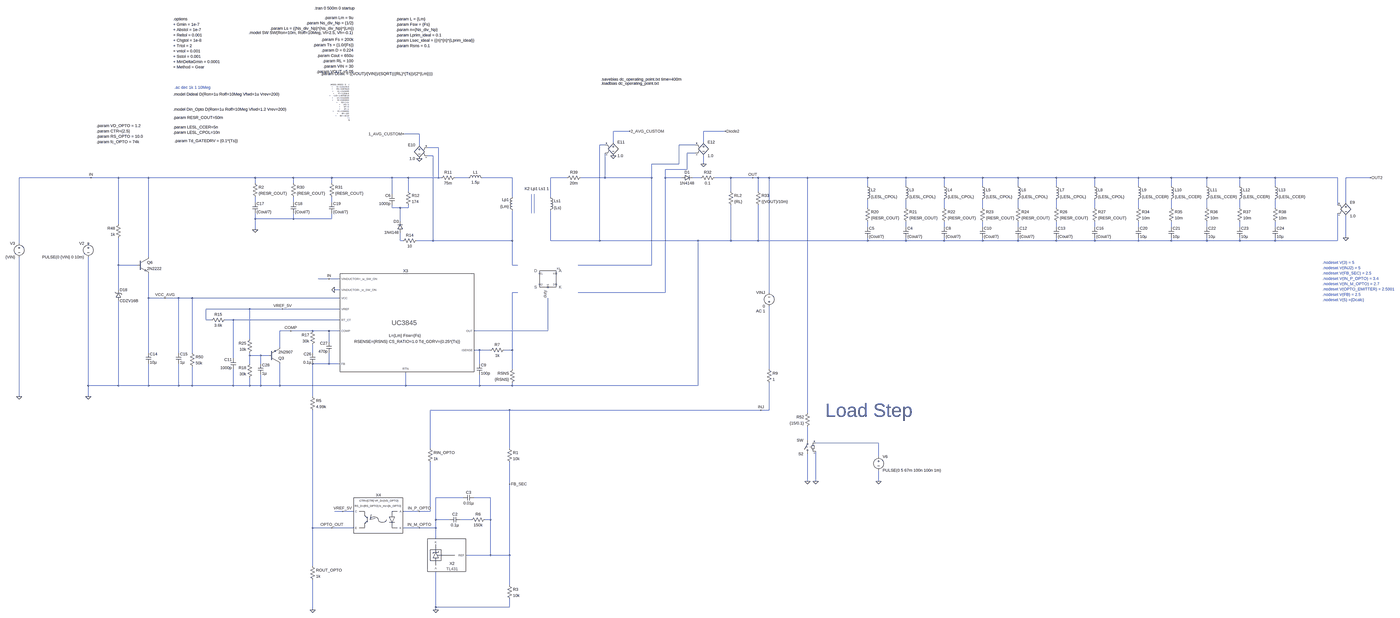
[diagram p0: schematic Demo_Flyback_AVGD_Model_Fsw_200kHz.asc, whole sheet]
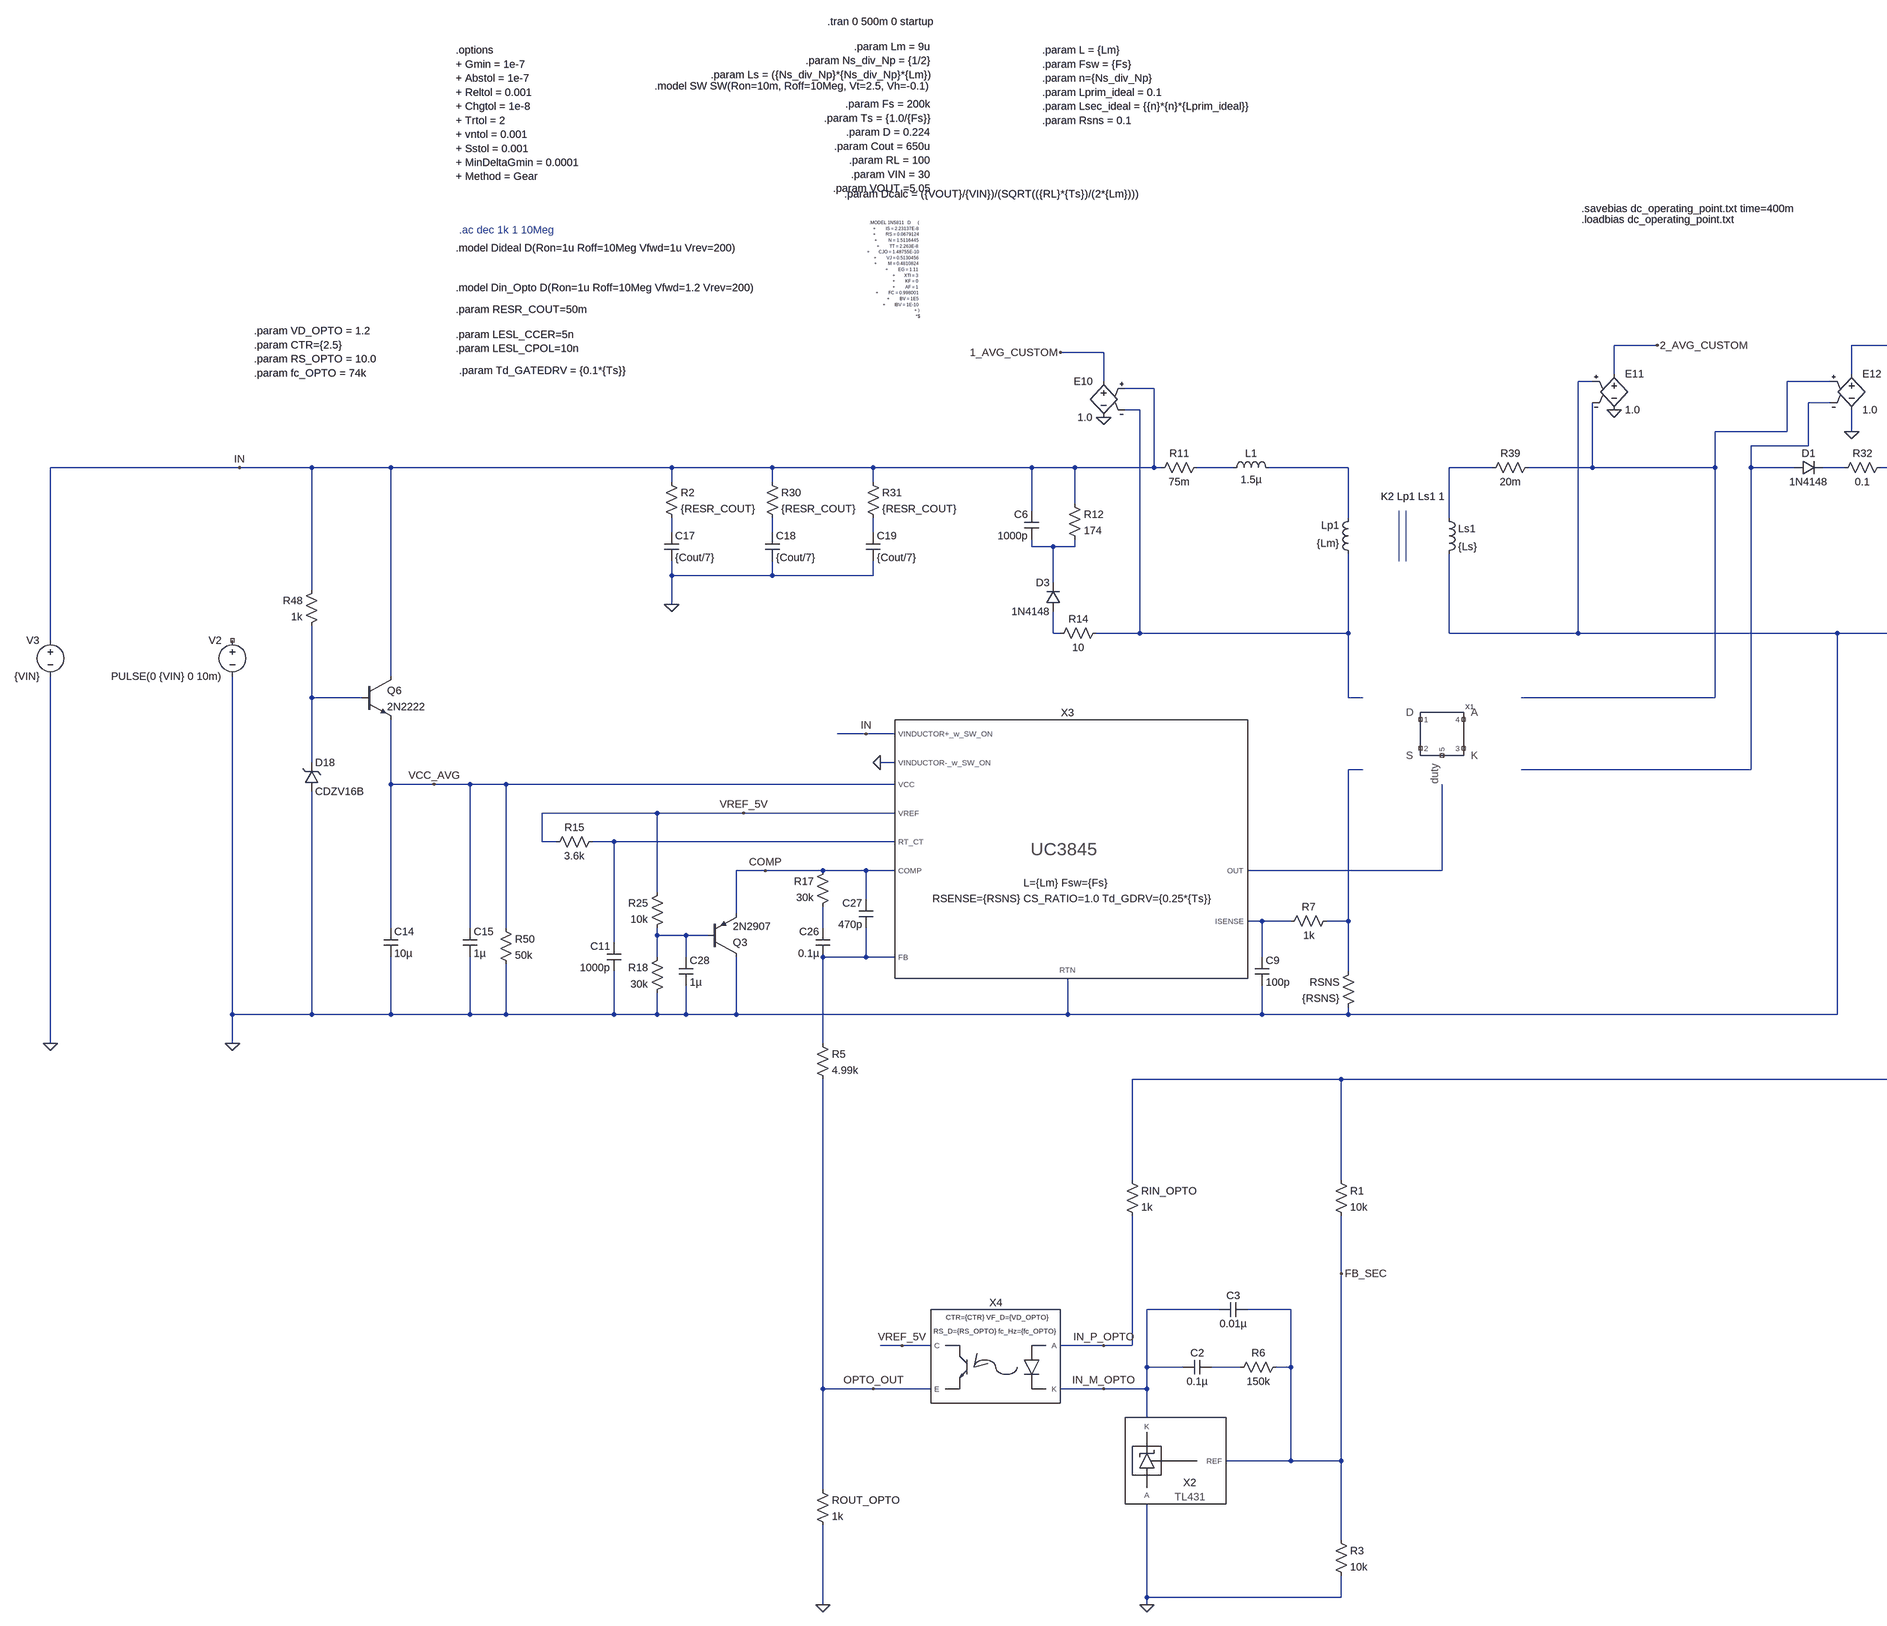
[diagram p1: schematic Demo_Flyback_AVGD_Model_Fsw_200kHz.asc, part, row 1 of 1, column 1 of 2]
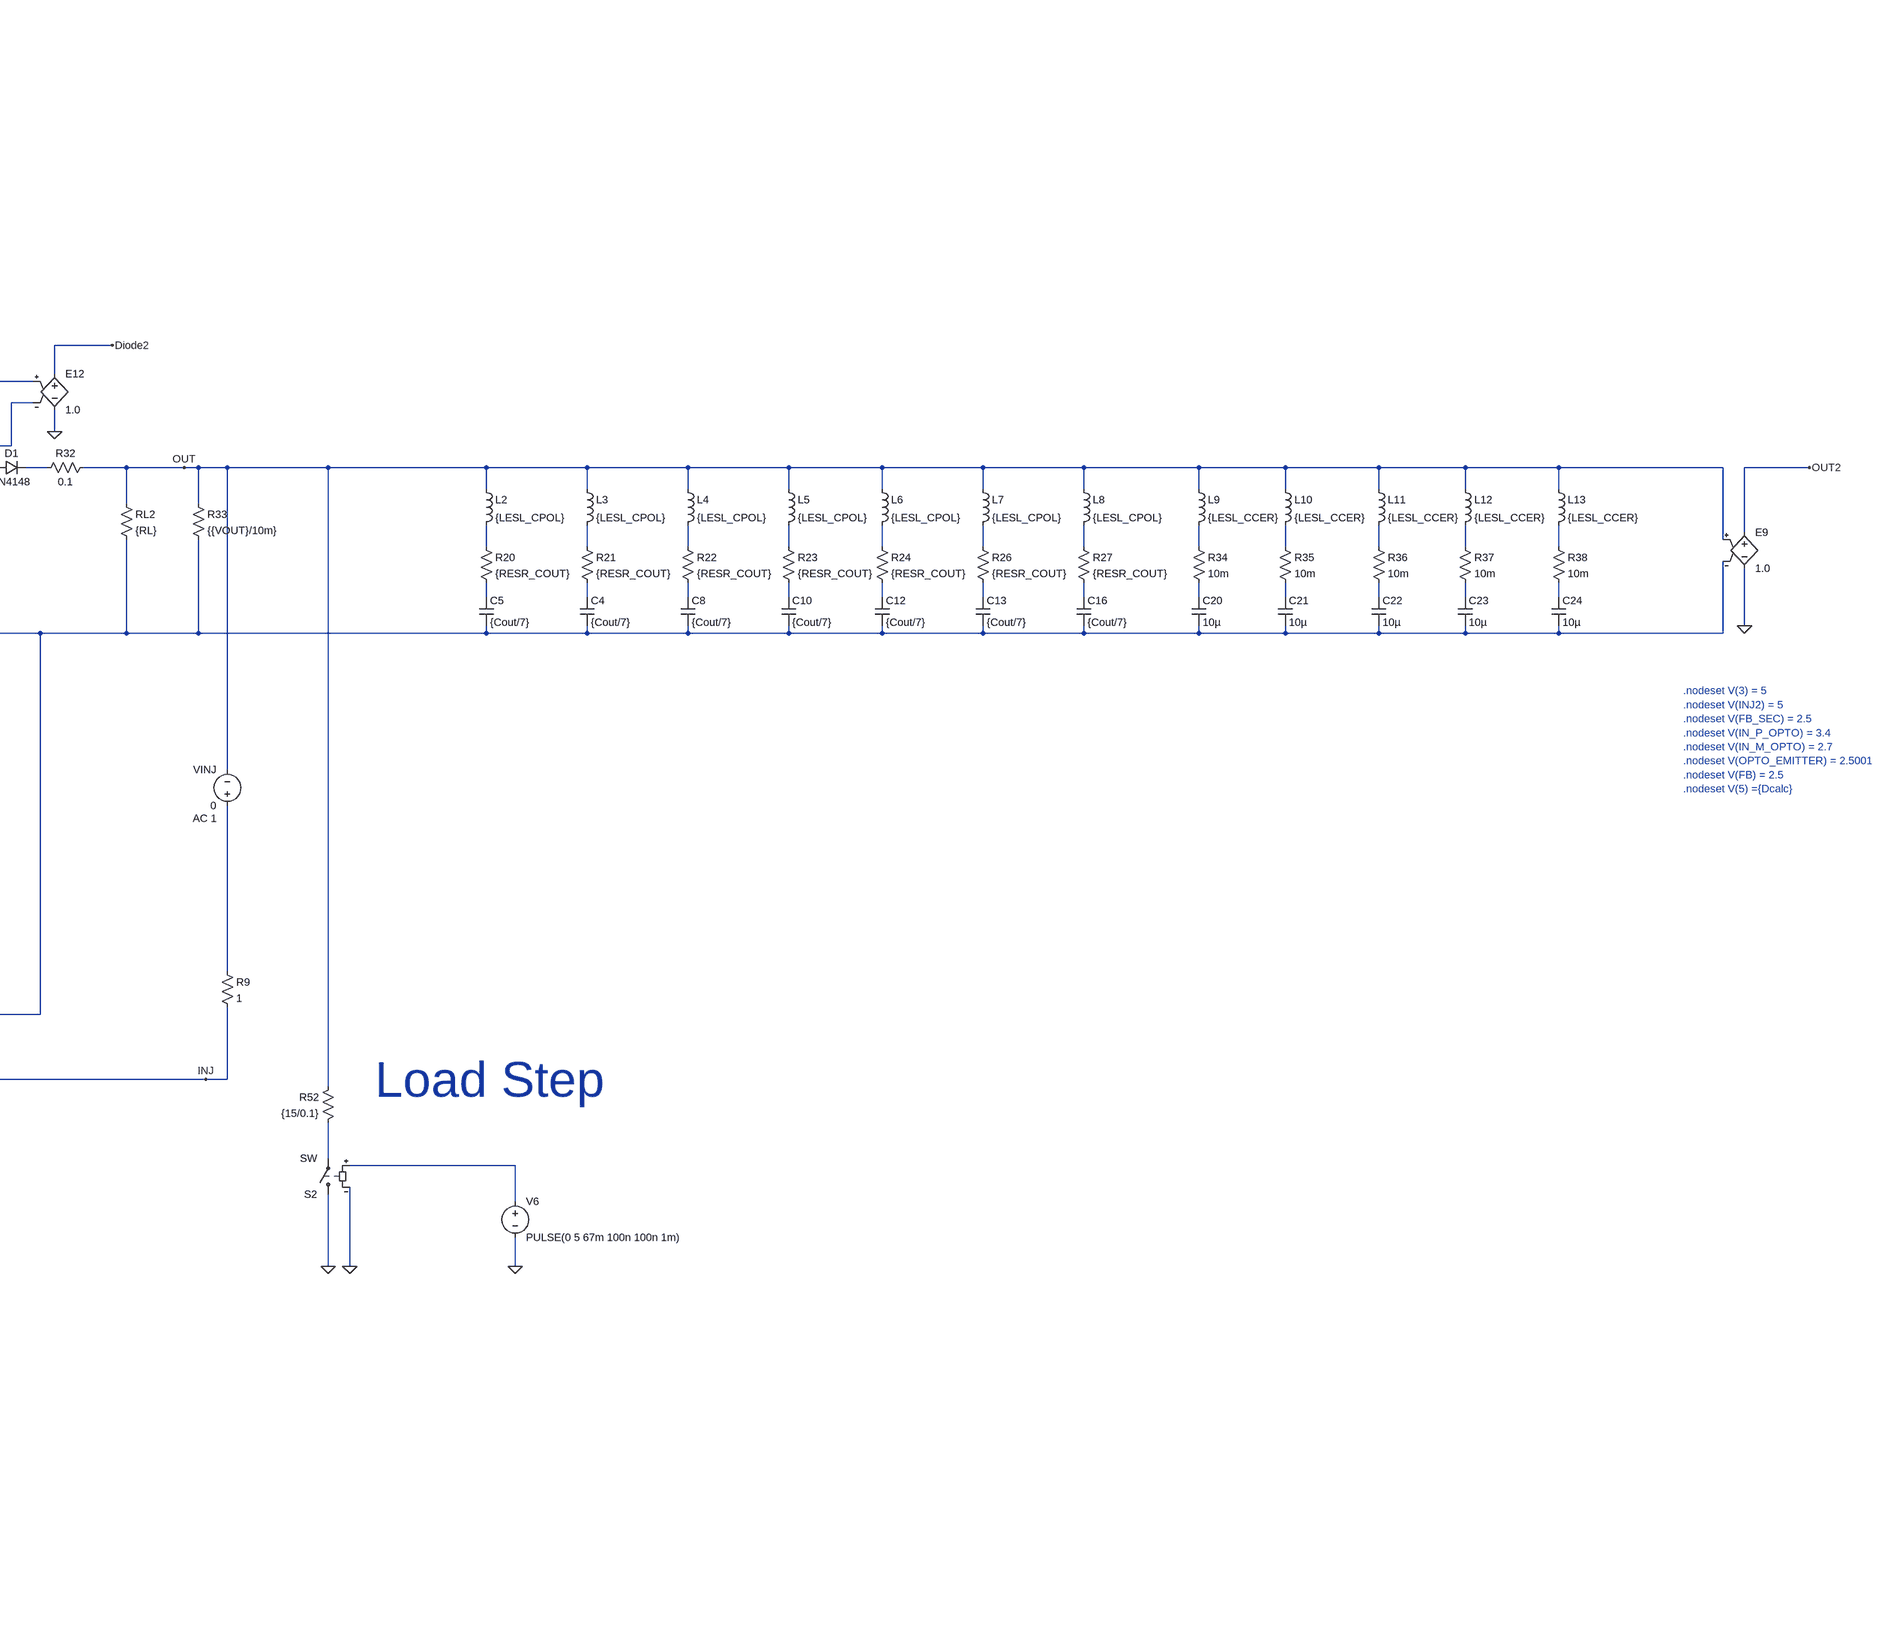
[diagram p2: schematic Demo_Flyback_AVGD_Model_Fsw_200kHz.asc, part, row 1 of 1, column 2 of 2]
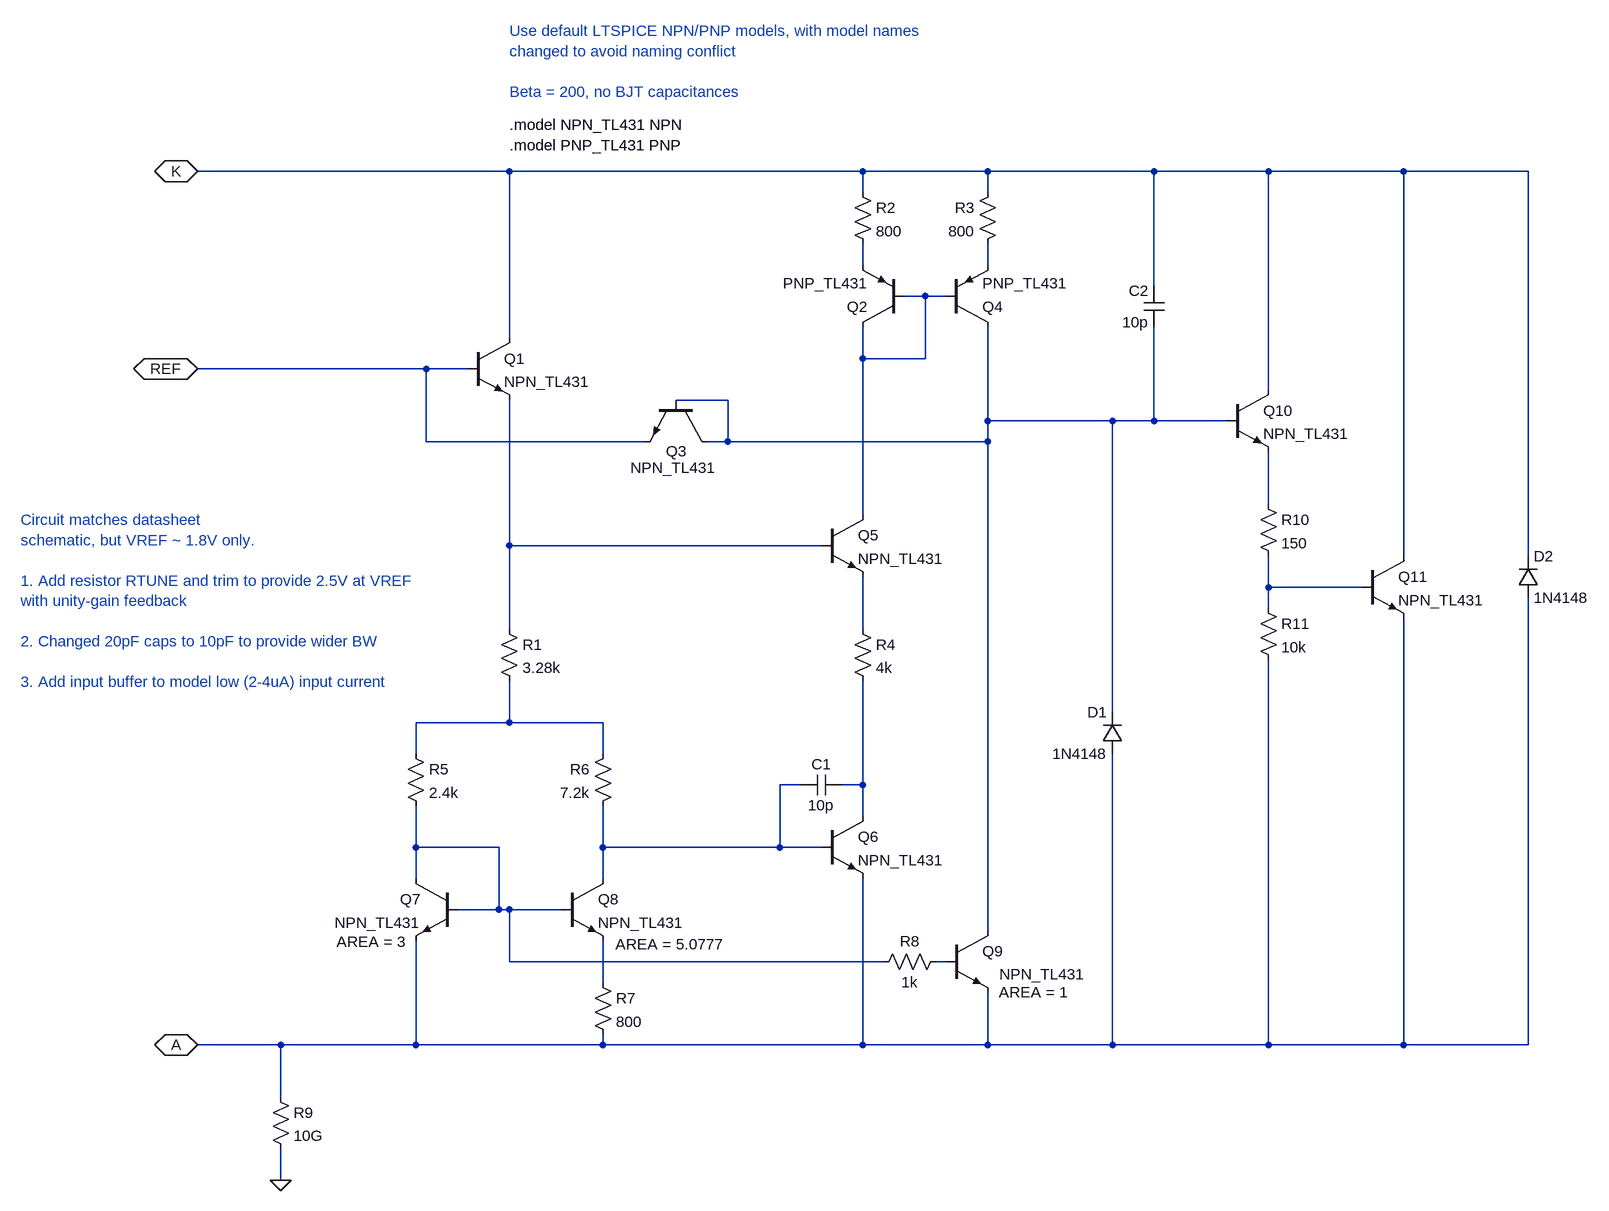
[diagram p3: sub-circuit tl431.asc]
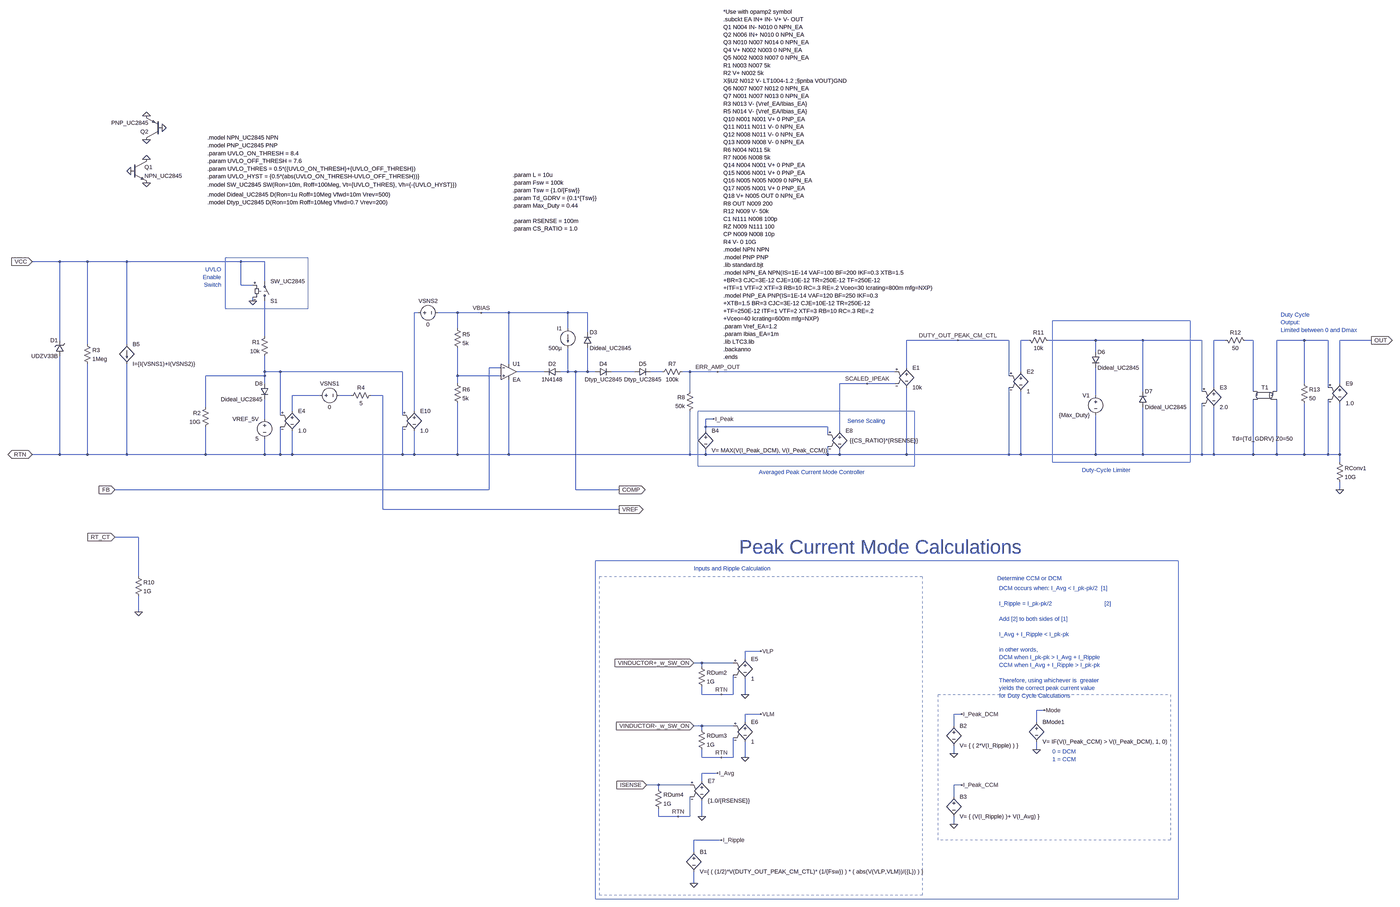
[diagram p4: sub-circuit uc3845_avg.asc, whole sheet]
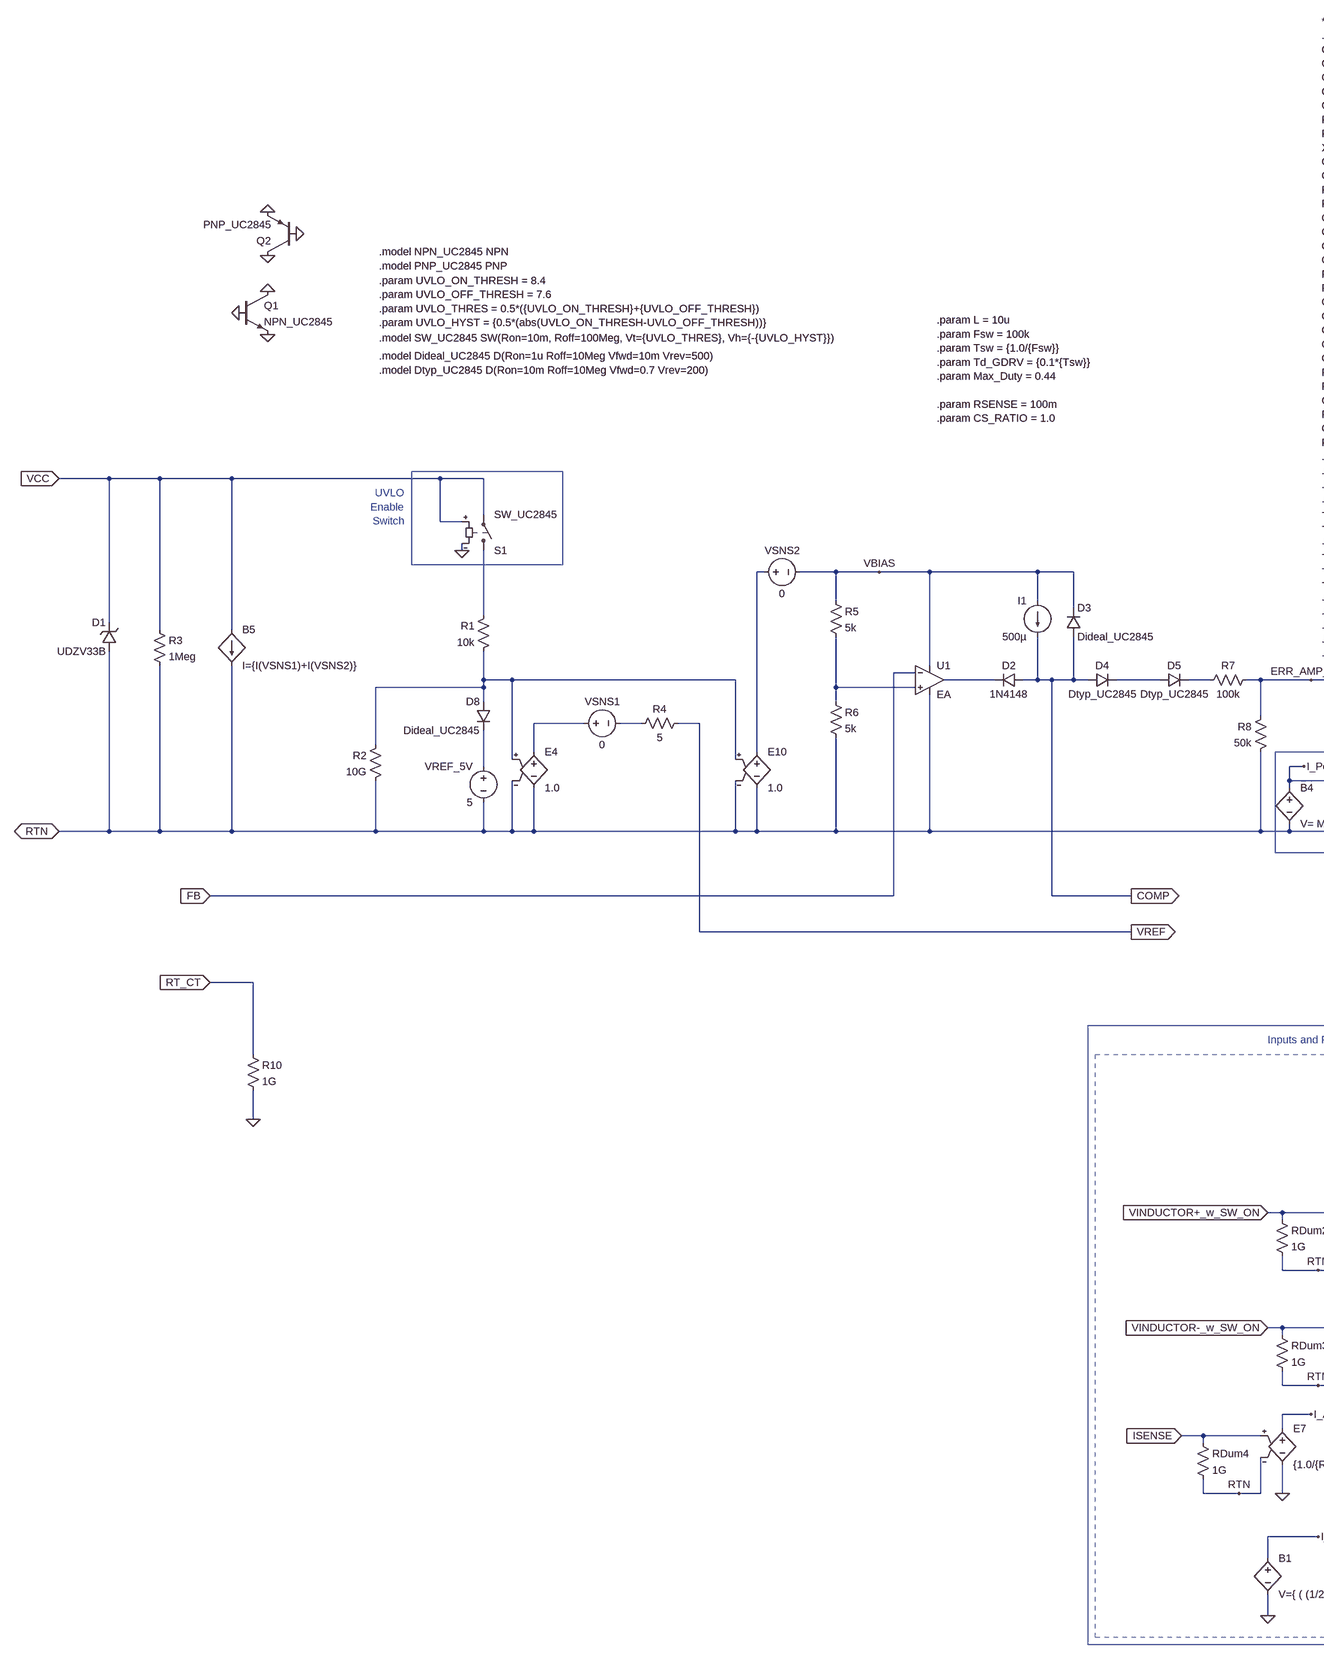
[diagram p5: sub-circuit uc3845_avg.asc, part, row 1 of 1, column 1 of 2]
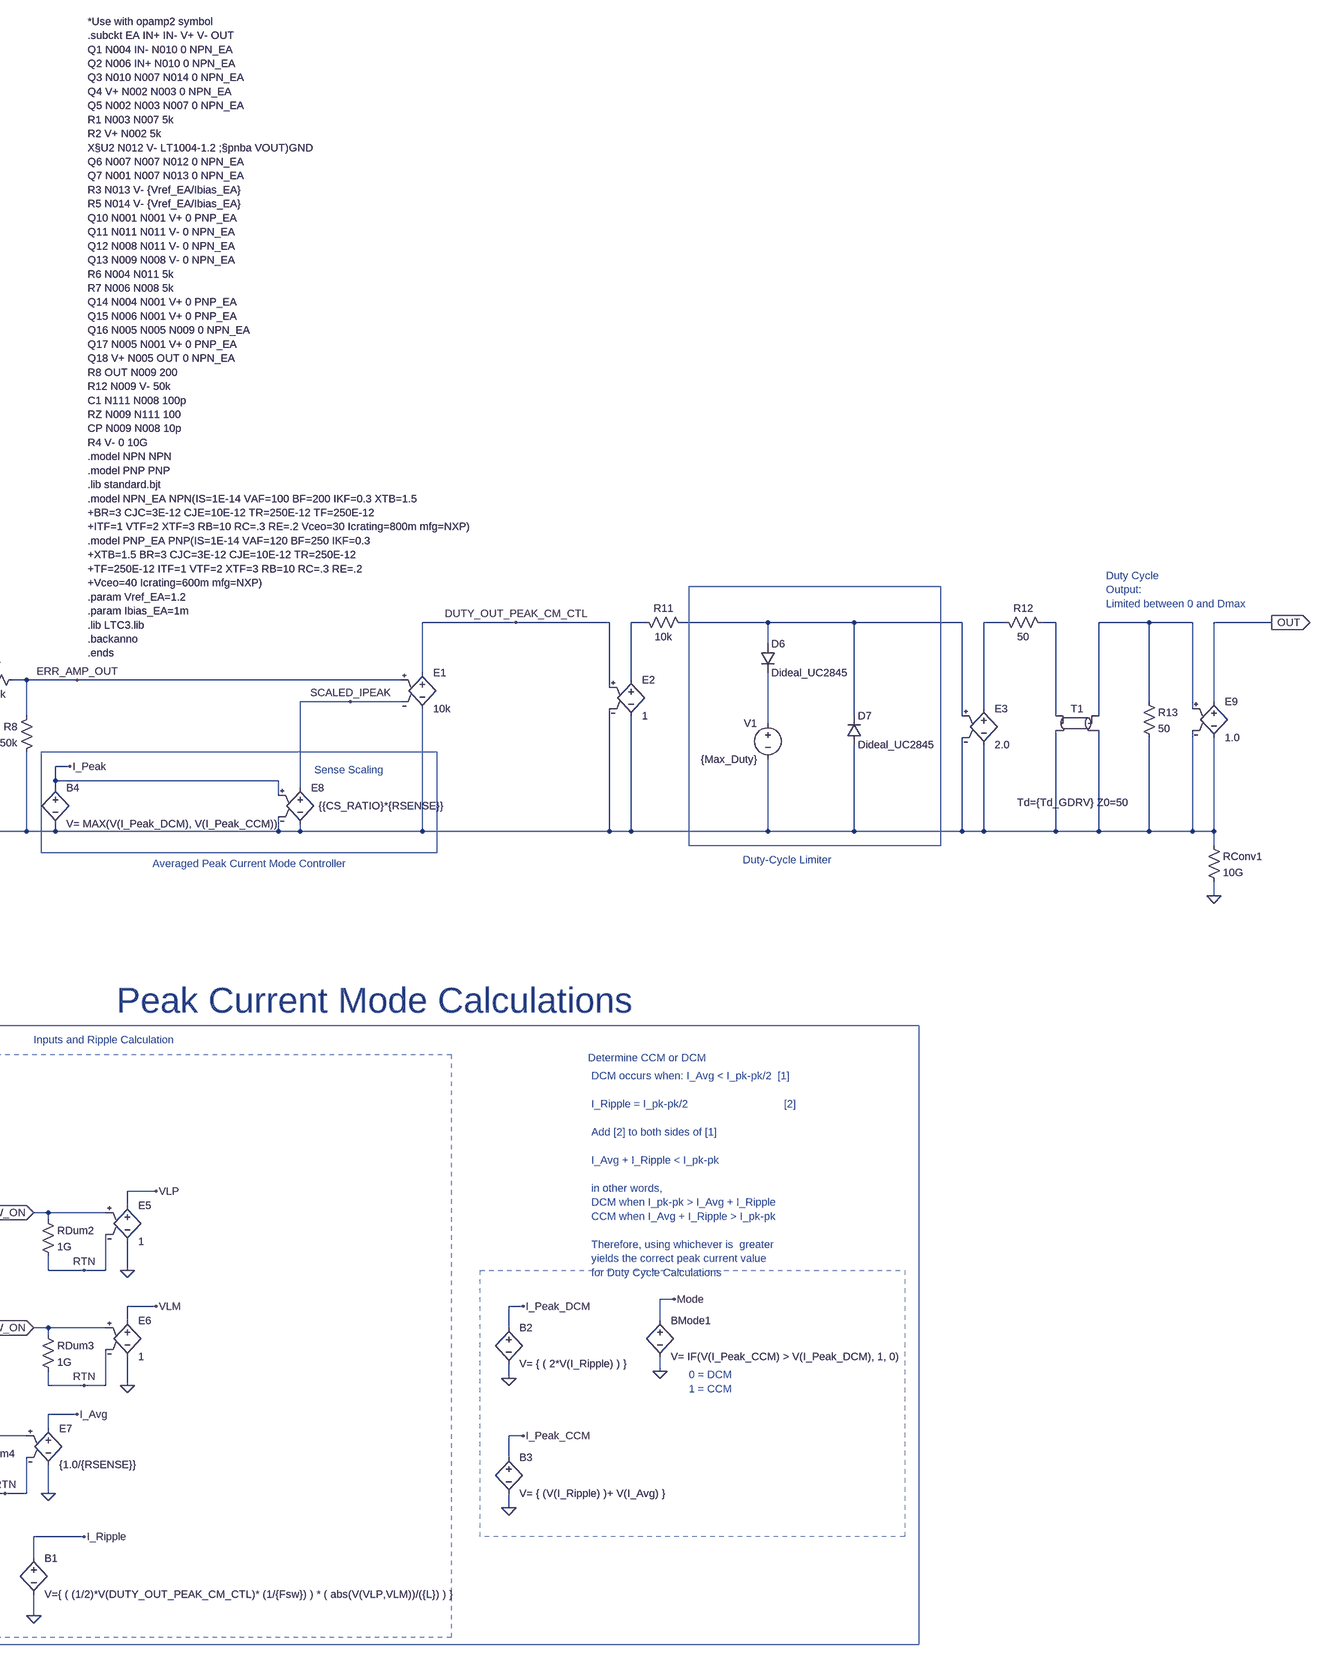
[diagram p6: sub-circuit uc3845_avg.asc, part, row 1 of 1, column 2 of 2]
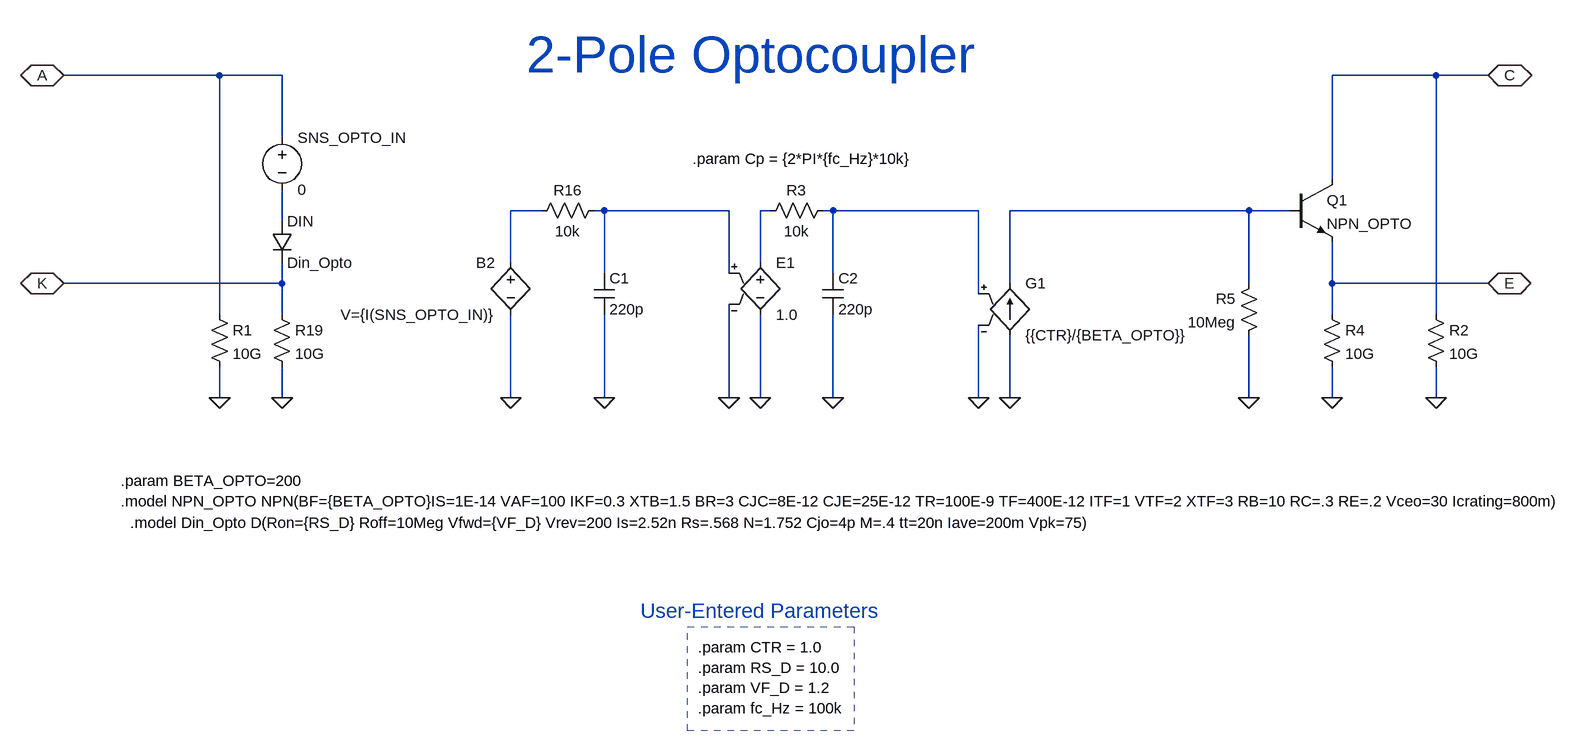
[diagram p7: sub-circuit opto_two_pole.asc]
Demo_Flyback_AVGD_Model_Fsw_200kHz.asc, the LTspice schematic file:
Version 4.1
SHEET 1 8320 5380
WIRE 3824 672 3728 672
WIRE 4384 672 4256 672
WIRE 2592 688 2496 688
WIRE 3728 736 3728 672
WIRE 4256 736 4256 672
WIRE 2592 752 2592 688
WIRE 3680 752 3648 752
WIRE 4208 752 4112 752
WIRE 2704 768 2640 768
WIRE 4208 800 4160 800
WIRE 2672 816 2640 816
WIRE 4112 864 4112 752
WIRE 4112 864 3952 864
WIRE 4256 864 4256 816
WIRE 4160 896 4160 800
WIRE 4160 896 4032 896
WIRE 672 944 240 944
WIRE 832 944 672 944
WIRE 1008 944 832 944
WIRE 1632 944 1008 944
WIRE 1856 944 1632 944
WIRE 2080 944 1856 944
WIRE 2432 944 2080 944
WIRE 2528 944 2432 944
WIRE 2704 944 2704 768
WIRE 2704 944 2528 944
WIRE 2720 944 2704 944
WIRE 2880 944 2800 944
WIRE 3136 944 2960 944
WIRE 3456 944 3360 944
WIRE 3680 944 3680 800
WIRE 3680 944 3536 944
WIRE 3952 944 3952 864
WIRE 3952 944 3680 944
WIRE 4032 944 4032 896
WIRE 4128 944 4032 944
WIRE 4240 944 4192 944
WIRE 4416 944 4320 944
WIRE 4544 944 4416 944
WIRE 4576 944 4544 944
WIRE 4640 944 4576 944
WIRE 4864 944 4640 944
WIRE 5216 944 4864 944
WIRE 5440 944 5216 944
WIRE 5664 944 5440 944
WIRE 5888 944 5664 944
WIRE 6096 944 5888 944
WIRE 6320 944 6096 944
WIRE 6544 944 6320 944
WIRE 6800 944 6544 944
WIRE 6992 944 6800 944
WIRE 7200 944 6992 944
WIRE 7392 944 7200 944
WIRE 7600 944 7392 944
WIRE 7968 944 7600 944
WIRE 8160 944 8016 944
WIRE 1632 976 1632 944
WIRE 1856 976 1856 944
WIRE 2080 976 2080 944
WIRE 5216 992 5216 944
WIRE 5440 992 5440 944
WIRE 5664 992 5664 944
WIRE 5888 992 5888 944
WIRE 6096 992 6096 944
WIRE 6320 992 6320 944
WIRE 6544 992 6544 944
WIRE 6800 992 6800 944
WIRE 6992 992 6992 944
WIRE 7200 992 7200 944
WIRE 7392 992 7392 944
WIRE 7600 992 7600 944
WIRE 2528 1024 2528 944
WIRE 4416 1024 4416 944
WIRE 4576 1024 4576 944
WIRE 2432 1040 2432 944
WIRE 3136 1056 3136 944
WIRE 3360 1056 3360 944
WIRE 1632 1088 1632 1056
WIRE 1856 1088 1856 1056
WIRE 2080 1088 2080 1056
WIRE 8016 1088 8016 944
WIRE 7968 1104 7968 944
WIRE 2432 1120 2432 1104
WIRE 2480 1120 2432 1120
WIRE 2528 1120 2528 1104
WIRE 2528 1120 2480 1120
WIRE 5216 1120 5216 1072
WIRE 5440 1120 5440 1072
WIRE 5664 1120 5664 1072
WIRE 5888 1120 5888 1072
WIRE 6096 1120 6096 1072
WIRE 6320 1120 6320 1072
WIRE 6544 1120 6544 1072
WIRE 6800 1120 6800 1072
WIRE 6992 1120 6992 1072
WIRE 7200 1120 7200 1072
WIRE 7392 1120 7392 1072
WIRE 7600 1120 7600 1072
WIRE 1632 1184 1632 1152
WIRE 1856 1184 1856 1152
WIRE 1856 1184 1632 1184
WIRE 2080 1184 2080 1152
WIRE 2080 1184 1856 1184
WIRE 2480 1200 2480 1120
WIRE 832 1216 832 944
WIRE 5216 1232 5216 1200
WIRE 5440 1232 5440 1200
WIRE 5664 1232 5664 1200
WIRE 5888 1232 5888 1200
WIRE 6096 1232 6096 1200
WIRE 6320 1232 6320 1200
WIRE 6544 1232 6544 1200
WIRE 6800 1232 6800 1200
WIRE 6992 1232 6992 1200
WIRE 7200 1232 7200 1200
WIRE 7392 1232 7392 1200
WIRE 7600 1232 7600 1200
WIRE 1632 1248 1632 1184
WIRE 8016 1296 8016 1168
WIRE 2480 1312 2480 1264
WIRE 2496 1312 2480 1312
WIRE 2672 1312 2672 816
WIRE 2672 1312 2576 1312
WIRE 3136 1312 3136 1136
WIRE 3136 1312 2672 1312
WIRE 3360 1312 3360 1136
WIRE 3648 1312 3648 752
WIRE 3648 1312 3360 1312
WIRE 4224 1312 3648 1312
WIRE 4416 1312 4416 1104
WIRE 4416 1312 4224 1312
WIRE 4576 1312 4576 1104
WIRE 4576 1312 4416 1312
WIRE 5216 1312 5216 1296
WIRE 5216 1312 4576 1312
WIRE 5440 1312 5440 1296
WIRE 5440 1312 5216 1312
WIRE 5664 1312 5664 1296
WIRE 5664 1312 5440 1312
WIRE 5888 1312 5888 1296
WIRE 5888 1312 5664 1312
WIRE 6096 1312 6096 1296
WIRE 6096 1312 5888 1312
WIRE 6320 1312 6320 1296
WIRE 6320 1312 6096 1312
WIRE 6544 1312 6544 1296
WIRE 6544 1312 6320 1312
WIRE 6800 1312 6800 1296
WIRE 6800 1312 6544 1312
WIRE 6992 1312 6992 1296
WIRE 6992 1312 6800 1312
WIRE 7200 1312 7200 1296
WIRE 7200 1312 6992 1312
WIRE 7392 1312 7392 1296
WIRE 7392 1312 7200 1312
WIRE 7600 1312 7600 1296
WIRE 7600 1312 7392 1312
WIRE 7968 1312 7968 1152
WIRE 7968 1312 7600 1312
WIRE 240 1328 240 944
WIRE 1008 1408 1008 944
WIRE 832 1456 832 1296
WIRE 944 1456 832 1456
WIRE 3136 1456 3136 1312
WIRE 3168 1456 3136 1456
WIRE 3952 1456 3952 944
WIRE 3952 1456 3520 1456
WIRE 2064 1536 2000 1536
WIRE 2128 1536 2064 1536
WIRE 832 1600 832 1456
WIRE 2128 1600 2096 1600
WIRE 3168 1616 3136 1616
WIRE 4032 1616 4032 944
WIRE 4032 1616 3520 1616
WIRE 4640 1616 4640 944
WIRE 1008 1648 1008 1504
WIRE 1104 1648 1008 1648
WIRE 1184 1648 1104 1648
WIRE 1264 1648 1184 1648
WIRE 2128 1648 1264 1648
WIRE 1600 1712 1344 1712
WIRE 1792 1712 1600 1712
WIRE 2128 1712 1792 1712
WIRE 1344 1776 1344 1712
WIRE 1376 1776 1344 1776
WIRE 1504 1776 1456 1776
WIRE 2128 1776 1504 1776
WIRE 1840 1840 1776 1840
WIRE 1968 1840 1840 1840
WIRE 2064 1840 1968 1840
WIRE 2128 1840 2064 1840
WIRE 3344 1840 3344 1648
WIRE 3344 1840 2912 1840
WIRE 1600 1888 1600 1712
WIRE 2064 1904 2064 1840
WIRE 1776 1936 1776 1840
WIRE 2944 1952 2912 1952
WIRE 3008 1952 2944 1952
WIRE 3136 1952 3136 1616
WIRE 3136 1952 3088 1952
WIRE 1008 1968 1008 1648
WIRE 1184 1968 1184 1648
WIRE 1264 1968 1264 1648
WIRE 1968 1968 1968 1920
WIRE 1600 1984 1600 1968
WIRE 1664 1984 1600 1984
WIRE 1712 1984 1664 1984
WIRE 1504 2000 1504 1776
WIRE 1600 2032 1600 1984
WIRE 1664 2032 1664 1984
WIRE 1968 2032 1968 2016
WIRE 2064 2032 2064 1968
WIRE 2064 2032 1968 2032
WIRE 2128 2032 2064 2032
WIRE 2944 2032 2944 1952
WIRE 3136 2064 3136 1952
WIRE 4640 2064 4640 1696
WIRE 656 2160 656 1408
WIRE 832 2160 832 1664
WIRE 832 2160 656 2160
WIRE 1008 2160 1008 2032
WIRE 1008 2160 832 2160
WIRE 1184 2160 1184 2032
WIRE 1184 2160 1008 2160
WIRE 1264 2160 1264 2048
WIRE 1264 2160 1184 2160
WIRE 1504 2160 1504 2064
WIRE 1504 2160 1264 2160
WIRE 1600 2160 1600 2112
WIRE 1600 2160 1504 2160
WIRE 1664 2160 1664 2096
WIRE 1664 2160 1600 2160
WIRE 1776 2160 1776 2032
WIRE 1776 2160 1664 2160
WIRE 2512 2160 2512 2080
WIRE 2512 2160 1776 2160
WIRE 2944 2160 2944 2096
WIRE 2944 2160 2512 2160
WIRE 3136 2160 3136 2144
WIRE 3136 2160 2944 2160
WIRE 4224 2160 4224 1312
WIRE 4224 2160 3136 2160
WIRE 240 2224 240 1408
WIRE 656 2224 656 2160
WIRE 1968 2224 1968 2032
WIRE 3120 2304 2656 2304
WIRE 4592 2304 3120 2304
WIRE 4640 2304 4640 2144
WIRE 4640 2304 4592 2304
WIRE 4864 2320 4864 944
WIRE 4864 2480 4864 2400
WIRE 5280 2496 4912 2496
WIRE 2656 2528 2656 2304
WIRE 3120 2528 3120 2304
WIRE 5280 2576 5280 2496
WIRE 4864 2720 4864 2560
WIRE 4912 2720 4912 2544
WIRE 5280 2720 5280 2656
WIRE 3120 2736 3120 2608
WIRE 2848 2816 2688 2816
WIRE 3008 2816 2912 2816
WIRE 2144 2896 2096 2896
WIRE 2208 2896 2144 2896
WIRE 2592 2896 2496 2896
WIRE 2656 2896 2656 2608
WIRE 2656 2896 2592 2896
WIRE 2688 2944 2688 2816
WIRE 2768 2944 2688 2944
WIRE 2896 2944 2832 2944
WIRE 3008 2944 3008 2816
WIRE 3008 2944 2976 2944
WIRE 1968 2992 1968 2304
WIRE 2080 2992 1968 2992
WIRE 2208 2992 2080 2992
WIRE 2592 2992 2496 2992
WIRE 2688 2992 2688 2944
WIRE 2688 2992 2592 2992
WIRE 2688 3056 2688 2992
WIRE 3008 3152 3008 2944
WIRE 3008 3152 2864 3152
WIRE 3120 3152 3120 2736
WIRE 3120 3152 3008 3152
WIRE 1968 3216 1968 2992
WIRE 3120 3328 3120 3152
WIRE 2688 3456 2688 3248
WIRE 3120 3456 3120 3408
WIRE 3120 3456 2688 3456
WIRE 1968 3472 1968 3296
WIRE 2688 3472 2688 3456
FLAG 8016 1296 0
FLAG 8160 944 OUT2
FLAG 2592 832 0
FLAG 3728 816 0
FLAG 2496 688 1_AVG_CUSTOM
FLAG 3824 672 2_AVG_CUSTOM
FLAG 4256 864 0
FLAG 4384 672 Diode2
FLAG 1104 1648 VCC_AVG
FLAG 4864 2720 0
FLAG 4912 2720 0
FLAG 5280 2720 0
FLAG 656 2224 0
FLAG 672 944 IN
FLAG 4592 2304 INJ
FLAG 2688 3472 0
FLAG 3120 2736 FB_SEC
FLAG 2592 2992 IN_M_OPTO
FLAG 4544 944 OUT
FLAG 240 2224 0
FLAG 1632 1248 0
FLAG 2064 1536 IN
FLAG 2096 1600 0
FLAG 1792 1712 VREF_5V
FLAG 2592 2896 IN_P_OPTO
FLAG 1968 3472 0
FLAG 2144 2896 VREF_5V
FLAG 1840 1840 COMP
FLAG 2080 2992 OPTO_OUT
DATAFLAG 4672 944 ""
DATAFLAG 2352 944 ""
DATAFLAG 3056 3152 ""
DATAFLAG 1264 1648 ""
DATAFLAG 4224 2080 ""
DATAFLAG 2656 2736 ""
DATAFLAG 2736 2816 ""
DATAFLAG 1968 2912 ""
DATAFLAG 1984 1712 ""
DATAFLAG 1984 1648 ""
DATAFLAG 2992 1840 ""
DATAFLAG 2032 1840 ""
SYMBOL res 4400 1008 R0
SYMATTR InstName RL2
SYMATTR Value {RL}
SYMBOL cap 5200 1232 R0
SYMATTR InstName C5
SYMATTR Value {Cout/7}
SYMBOL e 8016 1072 R0
SYMATTR InstName E9
SYMATTR Value 1.0
SYMBOL res 2704 960 R270
WINDOW 0 32 56 VTop 2
WINDOW 3 0 56 VBottom 2
SYMATTR InstName R11
SYMATTR Value 75m
SYMBOL e 2592 736 M0
SYMATTR InstName E10
SYMATTR Value 1.0
SYMBOL e 3728 720 R0
SYMATTR InstName E11
SYMATTR Value 1.0
SYMBOL diode 2496 1264 R180
WINDOW 0 24 64 Left 2
WINDOW 3 24 0 Left 2
SYMATTR InstName D3
SYMATTR Value 1N4148
SYMBOL cap 2448 1040 M0
SYMATTR InstName C6
SYMATTR Value 1000p
SYMBOL res 2512 1008 R0
SYMATTR InstName R12
SYMATTR Value 174
SYMBOL e 4256 720 R0
SYMATTR InstName E12
SYMATTR Value 1.0
SYMBOL res 2592 1296 R90
WINDOW 0 0 56 VBottom 2
WINDOW 3 32 56 VTop 2
SYMATTR InstName R14
SYMATTR Value 10
SYMBOL res 3152 2048 M0
SYMATTR InstName RSNS
SYMATTR Value {RSNS}
SYMBOL zener 816 1664 M180
WINDOW 0 24 64 Left 2
WINDOW 3 24 0 Left 2
SYMATTR InstName D18
SYMATTR Value CDZV16B
SYMBOL res 848 1200 M0
SYMATTR InstName R48
SYMATTR Value 1k
SYMBOL npn 944 1408 R0
SYMATTR InstName Q6
SYMATTR Value 2N2222
SYMBOL cap 992 1968 R0
SYMATTR InstName C14
SYMATTR Value 10µ
SYMBOL cap 1168 1968 R0
SYMATTR InstName C15
SYMATTR Value 1µ
SYMBOL res 1248 1952 R0
SYMATTR InstName R50
SYMATTR Value 50k
SYMBOL sw 4864 2576 R180
SYMATTR InstName S2
SYMBOL res 4880 2304 M0
SYMATTR InstName R52
SYMATTR Value {15/0.1}
SYMBOL voltage 5280 2560 R0
WINDOW 123 0 0 Left 0
WINDOW 39 0 0 Left 0
SYMATTR InstName V6
SYMATTR Value PULSE(0 5 67m 100n 100n 1m)
SYMBOL ind 3152 1152 R180
WINDOW 0 36 80 Left 2
WINDOW 3 36 40 Left 2
SYMATTR InstName Lp1
SYMATTR Value {Lm}
SYMATTR Type ind
SYMBOL ind 3344 1040 R0
SYMATTR InstName Ls1
SYMATTR Value {Ls}
SYMATTR Type ind
SYMBOL voltage 656 1312 M0
WINDOW 123 0 0 Left 0
WINDOW 39 0 0 Left 0
SYMATTR InstName V2
SYMATTR Value PULSE(0 {VIN} 0 10m)
SYMBOL res 3104 2512 R0
SYMATTR InstName R1
SYMATTR Value 10k
SYMBOL res 3104 3312 R0
SYMATTR InstName R3
SYMATTR Value 10k
SYMBOL cap 2832 2928 R90
WINDOW 0 0 32 VBottom 2
WINDOW 3 32 32 VTop 2
SYMATTR InstName C2
SYMATTR Value 0.1µ
SYMBOL res 2992 2928 R90
WINDOW 0 0 56 VBottom 2
WINDOW 3 32 56 VTop 2
SYMATTR InstName R6
SYMATTR Value 150k
SYMBOL res 2640 2512 R0
SYMATTR InstName RIN_OPTO
SYMATTR Value 1k
SYMBOL res 4624 2048 R0
SYMATTR InstName R9
SYMATTR Value 1
SYMBOL cap 2912 2800 R90
WINDOW 0 0 32 VBottom 2
WINDOW 3 32 32 VTop 2
SYMATTR InstName C3
SYMATTR Value 0.01µ
SYMBOL voltage 4640 1712 R180
WINDOW 0 24 96 Left 2
WINDOW 3 24 16 Left 2
WINDOW 123 24 -12 Left 2
WINDOW 39 0 0 Left 0
SYMATTR InstName VINJ
SYMATTR Value 0
SYMATTR Value2 AC 1
SYMBOL TL431 2752 3152 M0
SYMATTR InstName X2
SYMBOL voltage 240 1312 M0
WINDOW 123 0 0 Left 0
WINDOW 39 0 0 Left 0
SYMATTR InstName V3
SYMATTR Value {VIN}
SYMBOL res 5200 1104 R0
SYMATTR InstName R20
SYMATTR Value {RESR_COUT}
SYMBOL diode 4128 960 R270
WINDOW 0 32 32 VTop 2
WINDOW 3 0 32 VBottom 2
SYMATTR InstName D1
SYMATTR Value 1N4148
SYMBOL cap 5424 1232 R0
SYMATTR InstName C4
SYMATTR Value {Cout/7}
SYMBOL res 5424 1104 R0
SYMATTR InstName R21
SYMATTR Value {RESR_COUT}
SYMBOL cap 5648 1232 R0
SYMATTR InstName C8
SYMATTR Value {Cout/7}
SYMBOL res 5648 1104 R0
SYMATTR InstName R22
SYMATTR Value {RESR_COUT}
SYMBOL cap 5872 1232 R0
SYMATTR InstName C10
SYMATTR Value {Cout/7}
SYMBOL res 5872 1104 R0
SYMATTR InstName R23
SYMATTR Value {RESR_COUT}
SYMBOL cap 6080 1232 R0
SYMATTR InstName C12
SYMATTR Value {Cout/7}
SYMBOL res 6080 1104 R0
SYMATTR InstName R24
SYMATTR Value {RESR_COUT}
SYMBOL cap 6304 1232 R0
SYMATTR InstName C13
SYMATTR Value {Cout/7}
SYMBOL res 6304 1104 R0
SYMATTR InstName R26
SYMATTR Value {RESR_COUT}
SYMBOL cap 6528 1232 R0
SYMATTR InstName C16
SYMATTR Value {Cout/7}
SYMBOL res 6528 1104 R0
SYMATTR InstName R27
SYMATTR Value {RESR_COUT}
SYMBOL ind 2864 960 R270
WINDOW 0 32 56 VTop 2
WINDOW 3 5 56 VBottom 2
SYMATTR InstName L1
SYMATTR Value 1.5µ
SYMBOL cap 1616 1088 R0
SYMATTR InstName C17
SYMATTR Value {Cout/7}
SYMBOL res 1616 960 R0
SYMATTR InstName R2
SYMATTR Value {RESR_COUT}
SYMBOL cap 1840 1088 R0
SYMATTR InstName C18
SYMATTR Value {Cout/7}
SYMBOL res 1840 960 R0
SYMATTR InstName R30
SYMATTR Value {RESR_COUT}
SYMBOL cap 2064 1088 R0
SYMATTR InstName C19
SYMATTR Value {Cout/7}
SYMBOL res 2064 960 R0
SYMATTR InstName R31
SYMATTR Value {RESR_COUT}
SYMBOL res 4336 928 R90
WINDOW 0 0 56 VBottom 2
WINDOW 3 32 56 VTop 2
SYMATTR InstName R32
SYMATTR Value 0.1
SYMBOL res 4560 1008 R0
SYMATTR InstName R33
SYMATTR Value {{VOUT}/10m}
SYMBOL ind 5200 976 R0
SYMATTR InstName L2
SYMATTR Value {LESL_CPOL}
SYMBOL ind 5424 976 R0
SYMATTR InstName L3
SYMATTR Value {LESL_CPOL}
SYMBOL ind 5648 976 R0
SYMATTR InstName L4
SYMATTR Value {LESL_CPOL}
SYMBOL ind 5872 976 R0
SYMATTR InstName L5
SYMATTR Value {LESL_CPOL}
SYMBOL ind 6080 976 R0
SYMATTR InstName L6
SYMATTR Value {LESL_CPOL}
SYMBOL ind 6304 976 R0
SYMATTR InstName L7
SYMATTR Value {LESL_CPOL}
SYMBOL ind 6528 976 R0
SYMATTR InstName L8
SYMATTR Value {LESL_CPOL}
SYMBOL cap 6784 1232 R0
SYMATTR InstName C20
SYMATTR Value 10µ
SYMBOL res 6784 1104 R0
SYMATTR InstName R34
SYMATTR Value 10m
SYMBOL ind 6784 976 R0
SYMATTR InstName L9
SYMATTR Value {LESL_CCER}
SYMBOL cap 6976 1232 R0
SYMATTR InstName C21
SYMATTR Value 10µ
SYMBOL res 6976 1104 R0
SYMATTR InstName R35
SYMATTR Value 10m
SYMBOL ind 6976 976 R0
SYMATTR InstName L10
SYMATTR Value {LESL_CCER}
SYMBOL cap 7184 1232 R0
SYMATTR InstName C22
SYMATTR Value 10µ
SYMBOL res 7184 1104 R0
SYMATTR InstName R36
SYMATTR Value 10m
SYMBOL ind 7184 976 R0
SYMATTR InstName L11
SYMATTR Value {LESL_CCER}
SYMBOL cap 7376 1232 R0
SYMATTR InstName C23
SYMATTR Value 10µ
SYMBOL res 7376 1104 R0
SYMATTR InstName R37
SYMATTR Value 10m
SYMBOL ind 7376 976 R0
SYMATTR InstName L12
SYMATTR Value {LESL_CCER}
SYMBOL cap 7584 1232 R0
SYMATTR InstName C24
SYMATTR Value 10µ
SYMBOL res 7584 1104 R0
SYMATTR InstName R38
SYMATTR Value 10m
SYMBOL ind 7584 976 R0
SYMATTR InstName L13
SYMATTR Value {LESL_CCER}
SYMBOL res 3552 928 R90
WINDOW 0 0 56 VBottom 2
WINDOW 3 32 56 VTop 2
SYMATTR InstName R39
SYMATTR Value 20m
SYMBOL cap 2928 2032 R0
SYMATTR InstName C9
SYMATTR Value 100p
SYMBOL res 2992 1968 R270
WINDOW 0 32 56 VTop 2
WINDOW 3 0 56 VBottom 2
SYMATTR InstName R7
SYMATTR Value 1k
SYMBOL cap 1520 2000 M0
SYMATTR InstName C11
SYMATTR Value 1000p
SYMBOL res 1360 1792 R270
WINDOW 0 32 56 VTop 2
WINDOW 3 0 56 VBottom 2
SYMATTR InstName R15
SYMATTR Value 3.6k
SYMBOL cap 1984 1968 M0
SYMATTR InstName C26
SYMATTR Value 0.1µ
SYMBOL res 1984 1824 M0
SYMATTR InstName R17
SYMATTR Value 30k
SYMBOL cap 2080 1904 M0
SYMATTR InstName C27
SYMATTR Value 470p
SYMBOL pnp 1712 2032 M180
SYMATTR InstName Q3
SYMATTR Value 2N2907
SYMBOL cap 1648 2032 R0
SYMATTR InstName C28
SYMATTR Value 1µ
SYMBOL res 1616 2016 M0
SYMATTR InstName R18
SYMATTR Value 30k
SYMBOL res 1616 1872 M0
SYMATTR InstName R25
SYMATTR Value 10k
SYMBOL UC3845_AVG 2512 1872 R0
SYMATTR InstName X3
SYMATTR SpiceLine L={Lm} Fsw={Fs}
SYMATTR SpiceLine2 RSENSE={RSNS} CS_RATIO=1.0 Td_GDRV={0.25*{Ts}}
SYMBOL ccm-dcm2 3344 1536 R0
SYMATTR InstName X1
SYMATTR SpiceLine L={Lm} Fsw={Fs} n={Ns_div_Np}
SYMBOL Opto_Two_Pole 2352 2928 M0
WINDOW 39 -4 -95 Center 1
WINDOW 40 2 -64 Center 1
SYMATTR SpiceLine CTR={CTR} VF_D={VD_OPTO}
SYMATTR SpiceLine2 RS_D={RS_OPTO} fc_Hz={fc_OPTO}
SYMATTR InstName X4
SYMBOL res 1952 3200 R0
SYMATTR InstName ROUT_OPTO
SYMATTR Value 1k
SYMBOL res 1952 2208 R0
SYMATTR InstName R5
SYMATTR Value 4.99k
TEXT 4968 2304 Left 7 ;Load Step
TEXT 3208 1008 Left 2 !K2 Lp1 Ls1 1
TEXT 7880 1440 Left 2 ;.nodeset V(3) = 5\n.nodeset V(INJ2) = 5\n.nodeset V(FB_SEC) = 2.5\n.nodeset V(IN_P_OPTO) = 3.4\n.nodeset V(IN_M_OPTO) = 2.7\n.nodeset V(OPTO_EMITTER) = 2.5001\n.nodeset V(FB) = 2.5\n.nodeset V(5) ={Dcalc}
TEXT 2216 -48 Right 2 !.tran 0 500m 0 startup
TEXT 2208 96 Right 2 !.model SW SW(Ron=10m, Roff=10Meg, Vt=2.5, Vh=-0.1)
TEXT 2208 136 Right 2 !.param Fs = 200k\n.param Ts = {1.0/{Fs}}\n.param D = 0.224\n.param Cout = 650u\n.param RL = 100\n.param VIN = 30\n.param VOUT =5.05
TEXT 2208 8 Right 2 !.param Lm = 9u\n.param Ns_div_Np = {1/2}\n.param Ls = ({Ns_div_Np}*{Ns_div_Np}*{Lm})
TEXT 2456 16 Left 2 !.param L = {Lm}\n.param Fsw = {Fs}\n.param n={Ns_div_Np}\n.param Lprim_ideal = 0.1\n.param Lsec_ideal = {{n}*{n}*{Lprim_ideal}}\n.param Rsns = 0.1
TEXT 2184 400 Right 0 !.MODEL 1N5811   D      (\n+         IS = 2.23137E-8\n+         RS = 0.0679124\n+          N = 1.5116445\n+         TT = 2.263E-8\n+        CJO = 1.48755E-10\n+         VJ = 0.5130456\n+          M = 0.4810824\n+         EG = 1.11\n+        XTI = 3\n+         KF = 0\n+         AF = 1\n+         FC = 0.998001\n+         BV = 1E5\n+        IBV = 1E-10\n+ )\n*$
TEXT 1152 16 Left 2 !.options\n+ Gmin = 1e-7\n+ Abstol = 1e-7\n+ Reltol = 0.001\n+ Chgtol = 1e-8\n+ Trtol = 2\n+ vntol = 0.001\n+ Sstol = 0.001\n+ MinDeltaGmin = 0.0001\n+ Method = Gear
TEXT 1152 456 Left 2 !.model Dideal D(Ron=1u Roff=10Meg Vfwd=1u Vrev=200)
TEXT 1160 416 Left 2 ;.ac dec 1k 1 10Meg
TEXT 2016 336 Left 2 !.param Dcalc = ({VOUT}/{VIN})/(SQRT(({RL}*{Ts})/(2*{Lm})))
TEXT 704 640 Left 2 !.param VD_OPTO = 1.2\n.param CTR={2.5}\n.param RS_OPTO = 10.0\n.param fc_OPTO = 74k
TEXT 3656 368 Left 2 !.savebias dc_operating_point.txt time=400m
TEXT 3656 392 Left 2 !.loadbias dc_operating_point.txt
TEXT 1152 544 Left 2 !.model Din_Opto D(Ron=1u Roff=10Meg Vfwd=1.2 Vrev=200)
TEXT 1152 592 Left 2 !.param RESR_COUT=50m
TEXT 1152 648 Left 2 !.param LESL_CCER=5n\n.param LESL_CPOL=10n
TEXT 1160 728 Left 2 !.param Td_GATEDRV = {0.1*{Ts}}
LINE Normal 3248 1152 3248 1040
LINE Normal 3264 1152 3264 1040

tl431.asc, the sub-circuit schematic file:
Version 4.1
SHEET 1 2508 1384
WIRE 128 -304 -352 -304
WIRE 672 -304 128 -304
WIRE 864 -304 672 -304
WIRE 1120 -304 864 -304
WIRE 1296 -304 1120 -304
WIRE 1504 -304 1296 -304
WIRE 1696 -304 1504 -304
WIRE 672 -272 672 -304
WIRE 864 -272 864 -304
WIRE 672 -160 672 -192
WIRE 864 -160 864 -192
WIRE 1120 -128 1120 -304
WIRE 768 -112 736 -112
WIRE 800 -112 768 -112
WIRE 128 -48 128 -304
WIRE 672 -16 672 -64
WIRE 768 -16 768 -112
WIRE 768 -16 672 -16
WIRE 0 0 -352 0
WIRE 64 0 0 0
WIRE 1296 32 1296 -304
WIRE 464 48 384 48
WIRE 864 80 864 -64
WIRE 1056 80 864 80
WIRE 1120 80 1120 -64
WIRE 1120 80 1056 80
WIRE 1232 80 1120 80
WIRE 0 112 0 0
WIRE 336 112 0 112
WIRE 464 112 464 48
WIRE 464 112 432 112
WIRE 864 112 864 80
WIRE 864 112 464 112
WIRE 1296 208 1296 128
WIRE 672 224 672 -16
WIRE 128 272 128 48
WIRE 608 272 128 272
WIRE 1504 288 1504 -304
WIRE 1696 288 1696 -304
WIRE 1296 336 1296 288
WIRE 1440 336 1296 336
WIRE 1296 368 1296 336
WIRE 128 400 128 272
WIRE 672 400 672 320
WIRE 1056 528 1056 80
WIRE 128 544 128 480
WIRE 128 544 -16 544
WIRE 272 544 128 544
WIRE -16 592 -16 544
WIRE 272 592 272 544
WIRE 576 640 544 640
WIRE 672 640 672 480
WIRE 672 640 640 640
WIRE 672 688 672 640
WIRE -16 736 -16 672
WIRE 112 736 -16 736
WIRE 272 736 272 672
WIRE 544 736 544 640
WIRE 544 736 272 736
WIRE 608 736 544 736
WIRE -16 784 -16 736
WIRE 272 784 272 736
WIRE 112 832 112 736
WIRE 112 832 48 832
WIRE 128 832 112 832
WIRE 208 832 128 832
WIRE 864 864 864 112
WIRE 128 912 128 832
WIRE 704 912 128 912
WIRE 800 912 784 912
WIRE 272 944 272 880
WIRE -224 1040 -352 1040
WIRE -16 1040 -16 880
WIRE -16 1040 -224 1040
WIRE 272 1040 272 1024
WIRE 272 1040 -16 1040
WIRE 672 1040 672 784
WIRE 672 1040 272 1040
WIRE 864 1040 864 960
WIRE 864 1040 672 1040
WIRE 1056 1040 1056 592
WIRE 1056 1040 864 1040
WIRE 1296 1040 1296 448
WIRE 1296 1040 1056 1040
WIRE 1504 1040 1504 384
WIRE 1504 1040 1296 1040
WIRE 1696 1040 1696 352
WIRE 1696 1040 1504 1040
WIRE -224 1120 -224 1040
WIRE -224 1248 -224 1200
FLAG -224 1248 0
FLAG -352 0 REF
IOPIN -352 0 BiDir
FLAG -352 -304 K
IOPIN -352 -304 BiDir
FLAG -352 1040 A
IOPIN -352 1040 BiDir
SYMBOL npn 64 -48 R0
SYMATTR InstName Q1
SYMATTR Value NPN_TL431
SYMBOL pnp 736 -64 R180
SYMATTR InstName Q2
SYMATTR Value PNP_TL431
SYMBOL npn 432 48 R90
WINDOW 0 79 31 VRight 2
WINDOW 3 104 -15 VRight 2
SYMATTR InstName Q3
SYMATTR Value NPN_TL431
SYMBOL res 112 384 R0
SYMATTR InstName R1
SYMATTR Value 3.28k
SYMBOL pnp 800 -64 M180
SYMATTR InstName Q4
SYMATTR Value PNP_TL431
SYMBOL res 656 -288 R0
SYMATTR InstName R2
SYMATTR Value 800
SYMBOL res 880 -288 M0
SYMATTR InstName R3
SYMATTR Value 800
SYMBOL npn 608 224 R0
SYMATTR InstName Q5
SYMATTR Value NPN_TL431
SYMBOL res 656 384 R0
SYMATTR InstName R4
SYMATTR Value 4k
SYMBOL npn 608 688 R0
SYMATTR InstName Q6
SYMATTR Value NPN_TL431
SYMBOL cap 640 624 R90
WINDOW 0 0 32 VBottom 2
WINDOW 3 32 32 VTop 2
SYMATTR InstName C1
SYMATTR Value 10p
SYMBOL npn 48 784 M0
WINDOW 123 80 97 Left 2
SYMATTR Value2 AREA = 3
SYMATTR InstName Q7
SYMATTR Value NPN_TL431
SYMBOL npn 208 784 R0
WINDOW 123 83 101 Left 2
SYMATTR Value2 AREA = 5.0777
SYMATTR InstName Q8
SYMATTR Value NPN_TL431
SYMBOL res -32 576 R0
SYMATTR InstName R5
SYMATTR Value 2.4k
SYMBOL res 288 576 M0
SYMATTR InstName R6
SYMATTR Value 7.2k
SYMBOL res 256 928 R0
SYMATTR InstName R7
SYMATTR Value 800
SYMBOL npn 800 864 R0
WINDOW 123 81 95 Left 2
WINDOW 3 82 67 Left 2
SYMATTR Value2 AREA = 1
SYMATTR InstName Q9
SYMATTR Value NPN_TL431
SYMBOL res 688 928 R270
WINDOW 0 32 56 VTop 2
WINDOW 3 0 56 VBottom 2
SYMATTR InstName R8
SYMATTR Value 1k
SYMBOL res -240 1104 R0
SYMATTR InstName R9
SYMATTR Value 10G
SYMBOL diode 1072 592 R180
WINDOW 0 24 64 Left 2
WINDOW 3 24 0 Left 2
SYMATTR InstName D1
SYMATTR Value 1N4148
SYMBOL cap 1136 -128 M0
SYMATTR InstName C2
SYMATTR Value 10p
SYMBOL npn 1232 32 R0
SYMATTR InstName Q10
SYMATTR Value NPN_TL431
SYMBOL res 1280 192 R0
SYMATTR InstName R10
SYMATTR Value 150
SYMBOL res 1280 352 R0
SYMATTR InstName R11
SYMATTR Value 10k
SYMBOL npn 1440 288 R0
SYMATTR InstName Q11
SYMATTR Value NPN_TL431
SYMBOL diode 1680 352 M180
WINDOW 0 24 64 Left 2
WINDOW 3 24 0 Left 2
SYMATTR InstName D2
SYMATTR Value 1N4148
TEXT -624 232 Left 2 ;Circuit matches datasheet\nschematic, but VREF ~ 1.8V only. \n \n1. Add resistor RTUNE and trim to provide 2.5V at VREF\nwith unity-gain feedback\n \n2. Changed 20pF caps to 10pF to provide wider BW\n \n3. Add input buffer to model low (2-4uA) input current
TEXT 128 -376 Left 2 !.model NPN_TL431 NPN
TEXT 128 -344 Left 2 !.model PNP_TL431 PNP
TEXT 128 -520 Left 2 ;Use default LTSPICE NPN/PNP models, with model names\nchanged to avoid naming conflict\n \nBeta = 200, no BJT capacitances

uc3845_avg.asc, the sub-circuit schematic file:
Version 4.1
SHEET 1 5444 3284
WIRE -736 -48 -848 -48
WIRE -624 -48 -736 -48
WIRE -464 -48 -624 -48
WIRE 0 -48 -464 -48
WIRE 96 -48 0 -48
WIRE 96 32 96 -48
WIRE 0 48 0 -48
WIRE 48 48 0 48
WIRE 48 112 48 96
WIRE 720 160 704 160
WIRE 880 160 800 160
WIRE 976 160 880 160
WIRE 1088 160 976 160
WIRE 1328 160 1088 160
WIRE 1408 160 1328 160
WIRE 880 224 880 160
WIRE 1328 224 1328 160
WIRE 1408 240 1408 160
WIRE 96 256 96 112
WIRE -736 272 -736 -48
WIRE 2912 272 2704 272
WIRE 3120 272 2912 272
WIRE 3200 272 3168 272
WIRE 3472 272 3280 272
WIRE 3664 272 3472 272
WIRE 3904 272 3664 272
WIRE 4000 272 3952 272
WIRE 4112 272 4080 272
WIRE 4320 272 4208 272
WIRE 4416 272 4320 272
WIRE 4592 272 4464 272
WIRE -624 288 -624 -48
WIRE -464 288 -464 -48
WIRE 3472 320 3472 272
WIRE 1088 368 1088 160
WIRE 1056 384 1008 384
WIRE 2704 384 2704 272
WIRE 96 400 96 336
WIRE 160 400 96 400
WIRE 656 400 160 400
WIRE 1232 400 1120 400
WIRE 1328 400 1328 304
WIRE 1328 400 1296 400
WIRE 1360 400 1328 400
WIRE 1408 400 1408 304
WIRE 1408 400 1360 400
WIRE 1440 400 1408 400
WIRE 1600 400 1504 400
WIRE 1712 400 1664 400
WIRE 1824 400 1792 400
WIRE 1936 400 1824 400
WIRE 2656 400 1936 400
WIRE 3168 400 3168 272
WIRE 96 416 96 400
WIRE 96 416 -144 416
WIRE 880 416 880 304
WIRE 1056 416 880 416
WIRE 3120 416 3120 272
WIRE 96 448 96 416
WIRE 880 448 880 416
WIRE 2544 448 2432 448
WIRE 2656 448 2544 448
WIRE 4320 448 4320 272
WIRE 4464 448 4464 272
WIRE 3952 464 3952 272
WIRE 4416 464 4416 272
WIRE 1824 480 1824 400
WIRE 3664 480 3664 272
WIRE 3904 480 3904 272
WIRE 4112 480 4112 272
WIRE 4208 480 4208 272
WIRE 320 496 208 496
WIRE 448 496 400 496
WIRE 576 496 528 496
WIRE 3472 496 3472 384
WIRE -144 544 -144 416
WIRE 208 560 208 496
WIRE 704 560 704 160
WIRE 160 576 160 400
WIRE 656 576 656 400
WIRE 96 592 96 512
WIRE 1920 592 1888 592
WIRE 1888 624 1888 592
WIRE 2384 624 1888 624
WIRE 1888 640 1888 624
WIRE 2432 640 2432 448
WIRE 2384 656 2384 624
WIRE -736 736 -736 336
WIRE -736 736 -848 736
WIRE -624 736 -624 368
WIRE -624 736 -736 736
WIRE -464 736 -464 368
WIRE -464 736 -624 736
WIRE -144 736 -144 624
WIRE -144 736 -464 736
WIRE 96 736 96 672
WIRE 96 736 -144 736
WIRE 160 736 160 624
WIRE 160 736 96 736
WIRE 208 736 208 640
WIRE 208 736 160 736
WIRE 656 736 656 624
WIRE 656 736 208 736
WIRE 704 736 704 640
WIRE 704 736 656 736
WIRE 880 736 880 528
WIRE 880 736 704 736
WIRE 1088 736 1088 432
WIRE 1088 736 880 736
WIRE 1824 736 1824 560
WIRE 1824 736 1088 736
WIRE 1888 736 1888 720
WIRE 1888 736 1824 736
WIRE 2384 736 2384 704
WIRE 2384 736 1888 736
WIRE 2432 736 2432 720
WIRE 2432 736 2384 736
WIRE 2704 736 2704 464
WIRE 2704 736 2432 736
WIRE 3120 736 3120 464
WIRE 3120 736 2704 736
WIRE 3168 736 3168 480
WIRE 3168 736 3120 736
WIRE 3472 736 3472 576
WIRE 3472 736 3168 736
WIRE 3664 736 3664 544
WIRE 3664 736 3472 736
WIRE 3904 736 3904 528
WIRE 3904 736 3664 736
WIRE 3952 736 3952 544
WIRE 3952 736 3904 736
WIRE 4112 736 4112 512
WIRE 4112 736 3952 736
WIRE 4208 736 4208 512
WIRE 4208 736 4112 736
WIRE 4320 736 4320 528
WIRE 4320 736 4208 736
WIRE 4416 736 4416 512
WIRE 4416 736 4320 736
WIRE 4464 736 4464 528
WIRE 4464 736 4416 736
WIRE 4464 768 4464 736
WIRE 1008 880 1008 384
WIRE 1008 880 -512 880
WIRE 1360 880 1360 400
WIRE 1536 880 1360 880
WIRE 4464 880 4464 848
WIRE 576 960 576 496
WIRE 1536 960 576 960
WIRE -416 1072 -512 1072
WIRE -416 1232 -416 1072
WIRE -416 1376 -416 1312
WIRE 2112 1536 2048 1536
WIRE 2048 1568 2048 1536
WIRE 1872 1584 1840 1584
WIRE 2000 1584 1872 1584
WIRE 1872 1600 1872 1584
WIRE 1872 1712 1872 1680
WIRE 1952 1712 1872 1712
WIRE 2000 1712 2000 1632
WIRE 2000 1712 1952 1712
WIRE 2048 1712 2048 1648
WIRE 3264 1776 3232 1776
WIRE 2112 1792 2048 1792
WIRE 2928 1792 2896 1792
WIRE 2048 1824 2048 1792
WIRE 3232 1824 3232 1776
WIRE 1872 1840 1840 1840
WIRE 2000 1840 1872 1840
WIRE 2896 1840 2896 1792
WIRE 1872 1856 1872 1840
WIRE 3232 1936 3232 1904
WIRE 2896 1952 2896 1920
WIRE 1872 1968 1872 1936
WIRE 1952 1968 1872 1968
WIRE 2000 1968 2000 1888
WIRE 2000 1968 1952 1968
WIRE 2048 1968 2048 1904
WIRE 1936 2032 1872 2032
WIRE 1872 2064 1872 2032
WIRE 1696 2080 1648 2080
WIRE 1824 2080 1696 2080
WIRE 2928 2080 2896 2080
WIRE 1696 2096 1696 2080
WIRE 2896 2128 2896 2080
WIRE 1696 2208 1696 2176
WIRE 1776 2208 1696 2208
WIRE 1824 2208 1824 2128
WIRE 1824 2208 1776 2208
WIRE 1872 2208 1872 2144
WIRE 2896 2240 2896 2208
WIRE 1952 2304 1840 2304
WIRE 1840 2352 1840 2304
WIRE 1840 2480 1840 2432
FLAG 48 112 0
FLAG -448 -416 0
FLAG -384 -640 0
FLAG -320 -592 0
FLAG -384 -368 0
FLAG 976 160 VBIAS
FLAG 1936 400 ERR_AMP_OUT
FLAG -512 880 FB
IOPIN -512 880 In
FLAG 1536 880 COMP
IOPIN 1536 880 Out
FLAG 1536 960 VREF
IOPIN 1536 960 Out
FLAG -512 1072 RT_CT
IOPIN -512 1072 In
FLAG -416 1376 0
FLAG -848 736 RTN
IOPIN -848 736 BiDir
FLAG 4464 880 0
FLAG 1952 1712 RTN
FLAG 2048 1712 0
FLAG 2112 1536 VLP
FLAG 1840 1584 VINDUCTOR+_w_SW_ON
IOPIN 1840 1584 In
FLAG 1952 1968 RTN
FLAG 2048 1968 0
FLAG 2112 1792 VLM
FLAG 1840 1840 VINDUCTOR-_w_SW_ON
IOPIN 1840 1840 In
FLAG 1776 2208 RTN
FLAG 1872 2208 0
FLAG 1936 2032 I_Avg
FLAG 1648 2080 ISENSE
IOPIN 1648 2080 In
FLAG 1840 2480 0
FLAG 1952 2304 I_Ripple
FLAG 2896 1952 0
FLAG 2928 1792 I_Peak_DCM
FLAG 2896 2240 0
FLAG 2928 2080 I_Peak_CCM
FLAG 1920 592 I_Peak
FLAG 3232 1936 0
FLAG 3264 1776 Mode
FLAG 2544 448 SCALED_IPEAK
FLAG 2912 272 DUTY_OUT_PEAK_CM_CTL
FLAG 4592 272 OUT
IOPIN 4592 272 Out
FLAG -848 -48 VCC
IOPIN -848 -48 In
FLAG -384 -464 0
FLAG -384 -544 0
SYMBOL npn -448 -464 R0
SYMATTR InstName Q1
SYMATTR Value NPN_UC2845
SYMBOL pnp -320 -544 R180
SYMATTR InstName Q2
SYMATTR Value PNP_UC2845
SYMBOL sw 96 128 M180
SYMATTR InstName S1
SYMATTR Value SW_UC2845
SYMBOL zener -720 336 R180
WINDOW 0 24 64 Left 2
WINDOW 3 24 0 Left 2
SYMATTR InstName D1
SYMATTR Value UDZV33B
SYMBOL diode 1296 384 R90
WINDOW 0 0 32 VBottom 2
WINDOW 3 32 32 VTop 2
SYMATTR InstName D2
SYMATTR Value 1N4148
SYMBOL current 1328 224 M0
WINDOW 123 0 0 Left 0
WINDOW 39 0 0 Left 0
SYMATTR InstName I1
SYMATTR Value 500µ
SYMBOL diode 1392 304 M180
WINDOW 0 24 64 Left 2
WINDOW 3 24 0 Left 2
SYMATTR InstName D3
SYMATTR Value Dideal_UC2845
SYMBOL res 864 208 R0
SYMATTR InstName R5
SYMATTR Value 5k
SYMBOL res 864 432 R0
SYMATTR InstName R6
SYMATTR Value 5k
SYMBOL diode 1440 384 M90
WINDOW 0 0 32 VBottom 2
WINDOW 3 32 32 VTop 2
SYMATTR InstName D4
SYMATTR Value Dtyp_UC2845
SYMBOL diode 1600 384 M90
WINDOW 0 0 32 VBottom 2
WINDOW 3 32 32 VTop 2
SYMATTR InstName D5
SYMATTR Value Dtyp_UC2845
SYMBOL res 1696 416 R270
WINDOW 0 32 56 VTop 2
WINDOW 3 0 56 VBottom 2
SYMATTR InstName R7
SYMATTR Value 100k
SYMBOL res 1840 464 M0
SYMATTR InstName R8
SYMATTR Value 50k
SYMBOL res -432 1216 R0
SYMATTR InstName R10
SYMATTR Value 1G
SYMBOL e 2704 368 R0
SYMATTR InstName E1
SYMATTR Value 10k
SYMBOL diode 3456 320 R0
SYMATTR InstName D6
SYMATTR Value Dideal_UC2845
SYMBOL voltage 3472 480 M0
WINDOW 123 0 0 Left 0
WINDOW 39 0 0 Left 0
SYMATTR InstName V1
SYMATTR Value {Max_Duty}
SYMBOL diode 3648 544 M180
WINDOW 0 24 64 Left 2
WINDOW 3 24 0 Left 2
SYMATTR InstName D7
SYMATTR Value Dideal_UC2845
SYMBOL e 3168 384 R0
SYMATTR InstName E2
SYMATTR Value 1
SYMBOL res 3184 256 M90
WINDOW 0 0 56 VBottom 2
WINDOW 3 32 56 VTop 2
SYMATTR InstName R11
SYMATTR Value 10k
SYMBOL e 3952 448 R0
SYMATTR InstName E3
SYMATTR Value 2.0
SYMBOL res 4096 288 M270
WINDOW 0 32 56 VTop 2
WINDOW 3 0 56 VBottom 2
SYMATTR InstName R12
SYMATTR Value 50
SYMBOL tline 4160 496 M0
WINDOW 3 10 192 Bottom 2
SYMATTR Value Td={Td_GDRV} Z0=50
SYMATTR InstName T1
SYMBOL res 4304 432 R0
SYMATTR InstName R13
SYMATTR Value 50
SYMBOL res 4448 752 R0
SYMATTR InstName RConv1
SYMATTR Value 10G
SYMBOL e 2048 1552 R0
SYMATTR InstName E5
SYMATTR Value 1
SYMBOL res 1856 1584 R0
SYMATTR InstName RDum2
SYMATTR Value 1G
SYMBOL e 2048 1808 R0
SYMATTR InstName E6
SYMATTR Value 1
SYMBOL res 1856 1840 R0
SYMATTR InstName RDum3
SYMATTR Value 1G
SYMBOL e 1872 2048 R0
SYMATTR InstName E7
SYMATTR Value {1.0/{RSENSE}}
SYMBOL res 1680 2080 R0
SYMATTR InstName RDum4
SYMATTR Value 1G
SYMBOL bv 1840 2336 R0
SYMATTR InstName B1
SYMATTR Value V={ ( (1/2)*V(DUTY_OUT_PEAK_CM_CTL)* (1/{Fsw}) ) * ( abs(V(VLP,VLM))/({L}) ) }
SYMBOL bv 2896 1824 R0
SYMATTR InstName B2
SYMATTR Value V= { ( 2*V(I_Ripple) ) }
SYMBOL bv 2896 2112 R0
SYMATTR InstName B3
SYMATTR Value V= { (V(I_Ripple) )+ V(I_Avg) }
SYMBOL bv 1888 624 R0
SYMATTR InstName B4
SYMATTR Value V= MAX(V(I_Peak_DCM), V(I_Peak_CCM))
SYMBOL e 2432 624 R0
WINDOW 3 41 56 Left 2
SYMATTR Value {{CS_RATIO}*{RSENSE}}
SYMATTR InstName E8
SYMBOL bv 3232 1808 R0
SYMATTR InstName BMode1
SYMATTR Value V= IF(V(I_Peak_CCM) > V(I_Peak_DCM), 1, 0)
SYMBOL e 4464 432 R0
SYMATTR InstName E9
SYMATTR Value 1.0
SYMBOL res 112 240 M0
SYMATTR InstName R1
SYMATTR Value 10k
SYMBOL e 208 544 R0
SYMATTR InstName E4
SYMATTR Value 1.0
SYMBOL res -128 528 M0
SYMATTR InstName R2
SYMATTR Value 10G
SYMBOL res -640 272 R0
SYMATTR InstName R3
SYMATTR Value 1Meg
SYMBOL e 704 544 R0
SYMATTR InstName E10
SYMATTR Value 1.0
SYMBOL diode 112 448 M0
SYMATTR InstName D8
SYMATTR Value Dideal_UC2845
SYMBOL voltage 96 576 M0
WINDOW 123 0 0 Left 0
WINDOW 39 0 0 Left 0
SYMATTR InstName VREF_5V
SYMATTR Value 5
SYMBOL voltage 304 496 R270
WINDOW 0 32 56 VTop 2
WINDOW 3 -32 56 VBottom 2
WINDOW 123 0 0 Left 0
WINDOW 39 0 0 Left 0
SYMATTR InstName VSNS1
SYMATTR Value 0
SYMBOL voltage 704 160 R270
WINDOW 0 32 56 VTop 2
WINDOW 3 -32 56 VBottom 2
WINDOW 123 0 0 Left 0
WINDOW 39 0 0 Left 0
SYMATTR InstName VSNS2
SYMATTR Value 0
SYMBOL bi -464 288 R0
SYMATTR InstName B5
SYMATTR Value I={I(VSNS1)+I(VSNS2)}
SYMBOL res 432 512 R270
WINDOW 0 32 56 VTop 2
WINDOW 3 0 56 VBottom 2
SYMATTR InstName R4
SYMATTR Value 5
SYMBOL OpAmps\\opamp2 1088 336 R0
SYMATTR InstName U1
SYMATTR Value EA
TEXT -136 -552 Left 2 !.model NPN_UC2845 NPN
TEXT -136 -520 Left 2 !.model PNP_UC2845 PNP
TEXT -136 -360 Left 2 !.model SW_UC2845 SW(Ron=10m, Roff=100Meg, Vt={UVLO_THRES}, Vh={-{UVLO_HYST}})
TEXT -136 -488 Left 2 !.param UVLO_ON_THRESH = 8.4\n.param UVLO_OFF_THRESH = 7.6\n.param UVLO_THRES = 0.5*({UVLO_ON_THRESH}+{UVLO_OFF_THRESH})\n.param UVLO_HYST = {0.5*(abs(UVLO_ON_THRESH-UVLO_OFF_THRESH))}
TEXT -80 -16 Right 2 ;UVLO\nEnable\nSwitch
TEXT -136 -320 Left 2 !.model Dideal_UC2845 D(Ron=1u Roff=10Meg Vfwd=10m Vrev=500)\n.model Dtyp_UC2845 D(Ron=10m Roff=10Meg Vfwd=0.7 Vrev=200)
TEXT 3080 1280 Left 2 ;DCM occurs when: I_Avg < I_pk-pk/2  [1]\n \nI_Ripple = I_pk-pk/2                                [2]\n  \nAdd [2] to both sides of [1]\n \nI_Avg + I_Ripple < I_pk-pk\n \nin other words,\nDCM when I_pk-pk > I_Avg + I_Ripple\nCCM when I_Avg + I_Ripple > I_pk-pk\n \nTherefore, using whichever is  greater\nyields the correct peak current value\nfor Duty Cycle Calculations
TEXT 3072 1240 Left 2 ;Determine CCM or DCM
TEXT 1840 1200 Left 2 ;Inputs and Ripple Calculation
TEXT 2464 600 Left 2 ;Sense Scaling
TEXT 3392 1944 Right 2 ;0 = DCM\n1 = CCM
TEXT 1104 -400 Left 2 !.param L = 10u\n.param Fsw = 100k\n.param Tsw = {1.0/{Fsw}}\n.param Td_GDRV = {0.1*{Tsw}}\n.param Max_Duty = 0.44\n \n.param RSENSE = 100m\n.param CS_RATIO = 1.0
TEXT 2104 808 Left 2 ;Averaged Peak Current Mode Controller
TEXT 2024 1112 Left 6 ;Peak Current Mode Calculations
TEXT 3416 800 Left 2 ;Duty-Cycle Limiter
TEXT 4224 168 Left 2 ;Duty Cycle\nOutput:\nLimited between 0 and Dmax
TEXT 1960 -1064 Left 2 !*Use with opamp2 symbol\n.subckt EA IN+ IN- V+ V- OUT\nQ1 N004 IN- N010 0 NPN_EA\nQ2 N006 IN+ N010 0 NPN_EA\nQ3 N010 N007 N014 0 NPN_EA\nQ4 V+ N002 N003 0 NPN_EA\nQ5 N002 N003 N007 0 NPN_EA\nR1 N003 N007 5k\nR2 V+ N002 5k\nX§U2 N012 V- LT1004-1.2 ;§pnba VOUT)GND\nQ6 N007 N007 N012 0 NPN_EA\nQ7 N001 N007 N013 0 NPN_EA\nR3 N013 V- {Vref_EA/Ibias_EA}\nR5 N014 V- {Vref_EA/Ibias_EA}\nQ10 N001 N001 V+ 0 PNP_EA\nQ11 N011 N011 V- 0 NPN_EA\nQ12 N008 N011 V- 0 NPN_EA\nQ13 N009 N008 V- 0 NPN_EA\nR6 N004 N011 5k\nR7 N006 N008 5k\nQ14 N004 N001 V+ 0 PNP_EA\nQ15 N006 N001 V+ 0 PNP_EA\nQ16 N005 N005 N009 0 NPN_EA\nQ17 N005 N001 V+ 0 PNP_EA\nQ18 V+ N005 OUT 0 NPN_EA\nR8 OUT N009 200\nR12 N009 V- 50k\nC1 N111 N008 100p\nRZ N009 N111 100\nCP N009 N008 10p\nR4 V- 0 10G\n.model NPN NPN\n.model PNP PNP\n.lib standard.bjt\n.model NPN_EA NPN(IS=1E-14 VAF=100 BF=200 IKF=0.3 XTB=1.5\n+BR=3 CJC=3E-12 CJE=10E-12 TR=250E-12 TF=250E-12\n+ITF=1 VTF=2 XTF=3 RB=10 RC=.3 RE=.2 Vceo=30 Icrating=800m mfg=NXP)\n.model PNP_EA PNP(IS=1E-14 VAF=120 BF=250 IKF=0.3\n+XTB=1.5 BR=3 CJC=3E-12 CJE=10E-12 TR=250E-12\n+TF=250E-12 ITF=1 VTF=2 XTF=3 RB=10 RC=.3 RE=.2\n+Vceo=40 Icrating=600m mfg=NXP)\n.param Vref_EA=1.2\n.param Ibias_EA=1m\n.lib LTC3.lib\n.backanno\n.ends
RECTANGLE Normal 272 144 -64 -64
RECTANGLE Normal 2768 2528 1456 1232 1
RECTANGLE Normal 3776 2304 2832 1712 1
RECTANGLE Normal 2736 784 1856 560
RECTANGLE Normal 3808 2544 1440 1168
RECTANGLE Normal 3856 768 3296 192

opto_two_pole.asc, the sub-circuit schematic file:
Version 4.1
SHEET 1 8304 5380
WIRE 2688 3808 2448 3808
WIRE 2784 3808 2688 3808
WIRE 4560 3808 4400 3808
WIRE 4640 3808 4560 3808
WIRE 2784 3904 2784 3808
WIRE 4400 3968 4400 3808
WIRE 3184 4016 3136 4016
WIRE 3280 4016 3264 4016
WIRE 3472 4016 3280 4016
WIRE 3536 4016 3520 4016
WIRE 3632 4016 3616 4016
WIRE 3856 4016 3632 4016
WIRE 4272 4016 3904 4016
WIRE 4336 4016 4272 4016
WIRE 2784 4032 2784 3984
WIRE 3136 4096 3136 4016
WIRE 3520 4096 3520 4016
WIRE 3280 4112 3280 4016
WIRE 3472 4112 3472 4016
WIRE 3632 4112 3632 4016
WIRE 2784 4128 2784 4096
WIRE 2784 4128 2448 4128
WIRE 3904 4128 3904 4016
WIRE 4272 4128 4272 4016
WIRE 4400 4128 4400 4064
WIRE 4640 4128 4400 4128
WIRE 3856 4144 3856 4016
WIRE 2688 4176 2688 3808
WIRE 2784 4176 2784 4128
WIRE 4400 4176 4400 4128
WIRE 4560 4176 4560 3808
WIRE 2688 4304 2688 4256
WIRE 2784 4304 2784 4256
WIRE 3136 4304 3136 4176
WIRE 3280 4304 3280 4176
WIRE 3472 4304 3472 4160
WIRE 3520 4304 3520 4176
WIRE 3632 4304 3632 4176
WIRE 3856 4304 3856 4192
WIRE 3904 4304 3904 4208
WIRE 4272 4304 4272 4208
WIRE 4400 4304 4400 4256
WIRE 4560 4304 4560 4256
FLAG 4400 4304 0
FLAG 3280 4304 0
FLAG 3136 4304 0
FLAG 2784 4304 0
FLAG 2688 4304 0
FLAG 4560 4304 0
FLAG 3472 4304 0
FLAG 3520 4304 0
FLAG 3856 4304 0
FLAG 3632 4304 0
FLAG 3904 4304 0
FLAG 2448 3808 A
IOPIN 2448 3808 BiDir
FLAG 2448 4128 K
IOPIN 2448 4128 BiDir
FLAG 4640 3808 C
IOPIN 4640 3808 BiDir
FLAG 4640 4128 E
IOPIN 4640 4128 BiDir
FLAG 4272 4304 0
SYMBOL diode 2768 4032 R0
SYMATTR InstName DIN
SYMATTR Value Din_Opto
SYMBOL res 4384 4160 R0
SYMATTR InstName R4
SYMATTR Value 10G
SYMBOL cap 3264 4112 R0
SYMATTR InstName C1
SYMATTR Value 220p
SYMBOL res 3280 4000 R90
WINDOW 0 0 56 VBottom 2
WINDOW 3 32 56 VTop 2
SYMATTR InstName R16
SYMATTR Value 10k
SYMBOL npn 4336 3968 R0
SYMATTR InstName Q1
SYMATTR Value NPN_OPTO
SYMBOL bv 3136 4080 M0
SYMATTR InstName B2
SYMATTR Value V={I(SNS_OPTO_IN)}
SYMBOL voltage 2784 3888 R0
WINDOW 123 0 0 Left 0
WINDOW 39 0 0 Left 0
SYMATTR InstName SNS_OPTO_IN
SYMATTR Value 0
SYMBOL res 2768 4160 R0
SYMATTR InstName R19
SYMATTR Value 10G
SYMBOL res 2672 4160 R0
SYMATTR InstName R1
SYMATTR Value 10G
SYMBOL res 4544 4160 R0
SYMATTR InstName R2
SYMATTR Value 10G
SYMBOL g 3904 4112 R0
SYMATTR InstName G1
SYMATTR Value {{CTR}/{BETA_OPTO}}
SYMBOL e 3520 4080 R0
SYMATTR InstName E1
SYMATTR Value 1.0
SYMBOL cap 3616 4112 R0
SYMATTR InstName C2
SYMATTR Value 220p
SYMBOL res 3632 4000 R90
WINDOW 0 0 56 VBottom 2
WINDOW 3 32 56 VTop 2
SYMATTR InstName R3
SYMATTR Value 10k
SYMBOL res 4288 4112 M0
SYMATTR InstName R5
SYMATTR Value 10Meg
TEXT 3424 4688 Left 2 !.param CTR = 1.0\n.param RS_D = 10.0\n.param VF_D = 1.2\n.param fc_Hz = 100k
TEXT 4048 4496 Right 2 !.model Din_Opto D(Ron={RS_D} Roff=10Meg Vfwd={VF_D} Vrev=200 Is=2.52n Rs=.568 N=1.752 Cjo=4p M=.4 tt=20n Iave=200m Vpk=75)
TEXT 2536 4432 Left 2 !.param BETA_OPTO=200\n.model NPN_OPTO NPN(BF={BETA_OPTO}IS=1E-14 VAF=100 IKF=0.3 XTB=1.5 BR=3 CJC=8E-12 CJE=25E-12 TR=100E-9 TF=400E-12 ITF=1 VTF=2 XTF=3 RB=10 RC=.3 RE=.2 Vceo=30 Icrating=800m)
TEXT 3160 3776 Left 6 ;2-Pole Optocoupler
TEXT 3416 3936 Left 2 !.param Cp = {2*PI*{fc_Hz}*10k}
TEXT 3336 4632 Left 3 ;User-Entered Parameters
RECTANGLE Normal 3664 4816 3408 4656 1

The netlist it stands for:
* Demo_Flyback_AVGD_Model_Fsw_200kHz.asc
RL2 OUT 0 {RL}
C5 N024 0 {Cout/7}
E9 OUT2 0 OUT 0 1.0
R11 IN N004 75m
E10 1_AVG_CUSTOM 0 IN N003 1.0
E11 2_AVG_CUSTOM 0 0 N001 1.0
D3 N036 N011 1N4148
C6 IN N011 1000p
R12 IN N011 174
E12 Diode2 0 N001 N002 1.0
R14 N003 N036 10
RSNS N038 0 {RSNS}
D18 0 N037 CDZV16B
R48 IN N037 1k
Q6 IN N037 VCC_AVG 0 2N2222
C14 VCC_AVG 0 10µ
C15 VCC_AVG 0 1µ
R50 VCC_AVG 0 50k
S2 0 N046 N047 0 SW
R52 OUT N046 {15/0.1}
V6 N047 0 PULSE(0 5 67m 100n 100n 1m)
Lp1 N003 N005 {Lm}
Ls1 N006 0 {Ls}
V2 NC_01 0 PULSE(0 {VIN} 0 10m)
R1 INJ FB_SEC 10k
R3 FB_SEC 0 10k
C2 N048 IN_M_OPTO 0.1µ
R6 FB_SEC N048 150k
RIN_OPTO INJ IN_P_OPTO 1k
R9 N045 INJ 1
C3 FB_SEC IN_M_OPTO 0.01µ
VINJ N045 OUT 0 AC 1
X§X2 0 IN_M_OPTO FB_SEC tl431
V3 IN 0 {VIN}
R20 N012 N024 {RESR_COUT}
D1 N002 N007 1N4148
C4 N025 0 {Cout/7}
R21 N013 N025 {RESR_COUT}
C8 N026 0 {Cout/7}
R22 N014 N026 {RESR_COUT}
C10 N027 0 {Cout/7}
R23 N015 N027 {RESR_COUT}
C12 N028 0 {Cout/7}
R24 N016 N028 {RESR_COUT}
C13 N029 0 {Cout/7}
R26 N017 N029 {RESR_COUT}
C16 N030 0 {Cout/7}
R27 N018 N030 {RESR_COUT}
L1 N004 N005 1.5µ
C17 N008 0 {Cout/7}
R2 IN N008 {RESR_COUT}
C18 N009 0 {Cout/7}
R30 IN N009 {RESR_COUT}
C19 N010 0 {Cout/7}
R31 IN N010 {RESR_COUT}
R32 OUT N007 0.1
R33 OUT 0 {{VOUT}/10m}
L2 OUT N012 {LESL_CPOL}
L3 OUT N013 {LESL_CPOL}
L4 OUT N014 {LESL_CPOL}
L5 OUT N015 {LESL_CPOL}
L6 OUT N016 {LESL_CPOL}
L7 OUT N017 {LESL_CPOL}
L8 OUT N018 {LESL_CPOL}
C20 N031 0 10µ
R34 N019 N031 10m
L9 OUT N019 {LESL_CCER}
C21 N032 0 10µ
R35 N020 N032 10m
L10 OUT N020 {LESL_CCER}
C22 N033 0 10µ
R36 N021 N033 10m
L11 OUT N021 {LESL_CCER}
C23 N034 0 10µ
R37 N022 N034 10m
L12 OUT N022 {LESL_CCER}
C24 N035 0 10µ
R38 N023 N035 10m
L13 OUT N023 {LESL_CCER}
R39 N001 N006 20m
C9 N041 0 100p
R7 N041 N038 1k
C11 N039 0 1000p
R15 VREF_5V N039 3.6k
C26 N042 N044 0.1µ
R17 COMP N042 30k
C27 COMP N044 470p
Q3 0 N043 COMP 0 2N2907
C28 N043 0 1µ
R18 N043 0 30k
R25 VREF_5V N043 10k
X§X3 N044 N041 N039 VCC_AVG IN 0 COMP N040 0 VREF_5V uc3845_avg params: L={Lm} Fsw={Fs} RSENSE={RSNS} CS_RATIO=1.0 Td_GDRV={0.25*{Ts}}
X§X1 NC_02 NC_03 NC_04 NC_05 NC_06 ccm-dcm2 L={Lm} Fsw={Fs} n={Ns_div_Np}  ; pins 1 2 3 4 5
X§X4 IN_P_OPTO VREF_5V OPTO_OUT IN_M_OPTO opto_two_pole params: CTR={CTR} VF_D={VD_OPTO} RS_D={RS_OPTO} fc_Hz={fc_OPTO}
ROUT_OPTO OPTO_OUT 0 1k
R5 N044 OPTO_OUT 4.99k

* block symbol definitions
.subckt tl431 A K REF
Q1 K REF N006 0 NPN_TL431
Q2 N003 N003 N001 0 PNP_TL431
Q3 N004 N004 REF 0 NPN_TL431
R1 N006 N009 3.28k
Q4 N004 N003 N002 0 PNP_TL431
R2 K N001 800
R3 K N002 800
Q5 N003 N006 N008 0 NPN_TL431
R4 N008 N011 4k
Q6 N011 N010 A 0 NPN_TL431
C1 N011 N010 10p
Q7 N012 N012 A 0 NPN_TL431 AREA = 3
Q8 N010 N012 N014 0 NPN_TL431 AREA = 5.0777
R5 N009 N012 2.4k
R6 N009 N010 7.2k
R7 N014 A 800
Q9 N004 N013 A 0 NPN_TL431 AREA = 1
R8 N012 N013 1k
R9 A 0 10G
D1 A N004 1N4148
C2 K N004 10p
Q10 K N004 N005 0 NPN_TL431
R10 N005 N007 150
R11 N007 A 10k
Q11 K N007 A 0 NPN_TL431
D2 A K 1N4148
* Circuit matches datasheet
* schematic, but VREF ~ 1.8V only.
* 1. Add resistor RTUNE and trim to provide 2.5V at VREF
* with unity-gain feedback
* 2. Changed 20pF caps to 10pF to provide wider BW
* 3. Add input buffer to model low (2-4uA) input current
.model NPN_TL431 NPN
.model PNP_TL431 PNP
* Use default LTSPICE NPN/PNP models, with model names
* changed to avoid naming conflict
* Beta = 200, no BJT capacitances
.ends tl431

.subckt uc3845_avg FB ISENSE RT_CT VCC VINDUCTOR+_w_SW_ON VINDUCTOR-_w_SW_ON COMP OUT RTN VREF
Q1 0 0 0 0 NPN_UC2845
Q2 0 0 0 0 PNP_UC2845
S1 N002 VCC VCC 0 SW_UC2845
D1 RTN VCC UDZV33B
D2 COMP N009 1N4148
I1 VBIAS COMP 500µ
D3 COMP VBIAS Dideal_UC2845
R5 VBIAS N012 5k
R6 N012 RTN 5k
D4 COMP N010 Dtyp_UC2845
D5 N010 N011 Dtyp_UC2845
R7 N011 ERR_AMP_OUT 100k
R8 ERR_AMP_OUT RTN 50k
R10 RT_CT 0 1G
E1 DUTY_OUT_PEAK_CM_CTL RTN ERR_AMP_OUT SCALED_IPEAK 10k
D6 N004 N015 Dideal_UC2845
V1 N015 RTN {Max_Duty}
D7 RTN N004 Dideal_UC2845
E2 N003 RTN DUTY_OUT_PEAK_CM_CTL RTN 1
R11 N003 N004 10k
E3 N005 RTN N004 RTN 2.0
R12 N006 N005 50
T1 N007 RTN N006 RTN Td={Td_GDRV} Z0=50
R13 N007 RTN 50
RConv1 RTN 0 10G
E5 VLP 0 VINDUCTOR+_w_SW_ON RTN 1
RDum2 VINDUCTOR+_w_SW_ON RTN 1G
E6 VLM 0 VINDUCTOR-_w_SW_ON RTN 1
RDum3 VINDUCTOR-_w_SW_ON RTN 1G
E7 I_Avg 0 ISENSE RTN {1.0/{RSENSE}}
RDum4 ISENSE RTN 1G
B1 I_Ripple 0 V={ ( (1/2)*V(DUTY_OUT_PEAK_CM_CTL)* (1/{Fsw}) ) * ( abs(V(VLP,VLM))/({L}) ) }
B2 I_Peak_DCM 0 V= { ( 2*V(I_Ripple) ) }
B3 I_Peak_CCM 0 V= { (V(I_Ripple) )+ V(I_Avg) }
B4 I_Peak RTN V= MAX(V(I_Peak_DCM), V(I_Peak_CCM))
E8 SCALED_IPEAK RTN I_Peak RTN {{CS_RATIO}*{RSENSE}}
BMode1 Mode 0 V= IF(V(I_Peak_CCM) > V(I_Peak_DCM), 1, 0)
E9 OUT RTN N007 RTN 1.0
R1 N002 N008 10k
E4 N013 RTN N008 RTN 1.0
R2 N008 RTN 10G
R3 VCC RTN 1Meg
E10 N001 RTN N008 RTN 1.0
D8 N008 N016 Dideal_UC2845
VREF_5V N016 RTN 5
VSNS1 N013 N014 0
VSNS2 N001 VBIAS 0
B5 VCC RTN I={I(VSNS1)+I(VSNS2)}
R4 N014 VREF 5
X§U1 N012 FB VBIAS RTN N009 EA  ; pins In+ In- V+ V- OUT
.model NPN_UC2845 NPN
.model PNP_UC2845 PNP
.model SW_UC2845 SW(Ron=10m, Roff=100Meg, Vt={UVLO_THRES}, Vh={-{UVLO_HYST}})
.param UVLO_ON_THRESH = 8.4
.param UVLO_OFF_THRESH = 7.6
.param UVLO_THRES = 0.5*({UVLO_ON_THRESH}+{UVLO_OFF_THRESH})
.param UVLO_HYST = {0.5*(abs(UVLO_ON_THRESH-UVLO_OFF_THRESH))}
* UVLO
* Enable
* Switch
.model Dideal_UC2845 D(Ron=1u Roff=10Meg Vfwd=10m Vrev=500)
.model Dtyp_UC2845 D(Ron=10m Roff=10Meg Vfwd=0.7 Vrev=200)
* DCM occurs when: I_Avg < I_pk-pk/2  [1]
* I_Ripple = I_pk-pk/2                                [2]
* Add [2] to both sides of [1]
* I_Avg + I_Ripple < I_pk-pk
* in other words,
* DCM when I_pk-pk > I_Avg + I_Ripple
* CCM when I_Avg + I_Ripple > I_pk-pk
* Therefore, using whichever is  greater
* yields the correct peak current value
* for Duty Cycle Calculations
* Determine CCM or DCM
* Inputs and Ripple Calculation
* Sense Scaling
* 0 = DCM
* 1 = CCM
.param L = 10u
.param Fsw = 100k
.param Tsw = {1.0/{Fsw}}
.param Td_GDRV = {0.1*{Tsw}}
.param Max_Duty = 0.44
.param RSENSE = 100m
.param CS_RATIO = 1.0
* Averaged Peak Current Mode Controller
* Peak Current Mode Calculations
* Duty-Cycle Limiter
* Duty Cycle
* Output:
* Limited between 0 and Dmax
*Use with opamp2 symbol
.subckt EA IN+ IN- V+ V- OUT
Q1 N004 IN- N010 0 NPN_EA
Q2 N006 IN+ N010 0 NPN_EA
Q3 N010 N007 N014 0 NPN_EA
Q4 V+ N002 N003 0 NPN_EA
Q5 N002 N003 N007 0 NPN_EA
R1 N003 N007 5k
R2 V+ N002 5k
X§U2 N012 V- LT1004-1.2 ;§pnba VOUT)GND
Q6 N007 N007 N012 0 NPN_EA
Q7 N001 N007 N013 0 NPN_EA
R3 N013 V- {Vref_EA/Ibias_EA}
R5 N014 V- {Vref_EA/Ibias_EA}
Q10 N001 N001 V+ 0 PNP_EA
Q11 N011 N011 V- 0 NPN_EA
Q12 N008 N011 V- 0 NPN_EA
Q13 N009 N008 V- 0 NPN_EA
R6 N004 N011 5k
R7 N006 N008 5k
Q14 N004 N001 V+ 0 PNP_EA
Q15 N006 N001 V+ 0 PNP_EA
Q16 N005 N005 N009 0 NPN_EA
Q17 N005 N001 V+ 0 PNP_EA
Q18 V+ N005 OUT 0 NPN_EA
R8 OUT N009 200
R12 N009 V- 50k
C1 N111 N008 100p
RZ N009 N111 100
CP N009 N008 10p
R4 V- 0 10G
.model NPN NPN
.model PNP PNP
.lib standard.bjt
.model NPN_EA NPN(IS=1E-14 VAF=100 BF=200 IKF=0.3 XTB=1.5
+BR=3 CJC=3E-12 CJE=10E-12 TR=250E-12 TF=250E-12
+ITF=1 VTF=2 XTF=3 RB=10 RC=.3 RE=.2 Vceo=30 Icrating=800m mfg=NXP)
.model PNP_EA PNP(IS=1E-14 VAF=120 BF=250 IKF=0.3
+XTB=1.5 BR=3 CJC=3E-12 CJE=10E-12 TR=250E-12
+TF=250E-12 ITF=1 VTF=2 XTF=3 RB=10 RC=.3 RE=.2
+Vceo=40 Icrating=600m mfg=NXP)
.param Vref_EA=1.2
.param Ibias_EA=1m
.lib LTC3.lib
.backanno
.ends
.ends uc3845_avg

.subckt opto_two_pole A C E K
DIN N006 K Din_Opto
R4 E 0 10G
C1 N002 0 220p
R16 N002 N001 10k
Q1 C N005 E 0 NPN_OPTO
B2 N001 0 V={I(SNS_OPTO_IN)}
V§SNS_OPTO_IN A N006 0
R19 K 0 10G
R1 A 0 10G
R2 C 0 10G
G1 0 N005 N004 0 {{CTR}/{BETA_OPTO}}
E1 N003 0 N002 0 1.0
C2 N004 0 220p
R3 N004 N003 10k
R5 N005 0 10Meg
.param CTR = 1.0
.param RS_D = 10.0
.param VF_D = 1.2
.param fc_Hz = 100k
.model Din_Opto D(Ron={RS_D} Roff=10Meg Vfwd={VF_D} Vrev=200 Is=2.52n Rs=.568 N=1.752 Cjo=4p M=.4 tt=20n Iave=200m Vpk=75)
.param BETA_OPTO=200
.model NPN_OPTO NPN(BF={BETA_OPTO}IS=1E-14 VAF=100 IKF=0.3 XTB=1.5 BR=3 CJC=8E-12 CJE=25E-12 TR=100E-9 TF=400E-12 ITF=1 VTF=2 XTF=3 RB=10 RC=.3 RE=.2 Vceo=30 Icrating=800m)
* 2-Pole Optocoupler
.param Cp = {2*PI*{fc_Hz}*10k}
* User-Entered Parameters
.ends opto_two_pole

.model D D
.lib standard.dio
.model NPN NPN
.model PNP PNP
.lib standard.bjt
* Load Step
K2 Lp1 Ls1 1
* .nodeset V(3) = 5
* .nodeset V(INJ2) = 5
* .nodeset V(FB_SEC) = 2.5
* .nodeset V(IN_P_OPTO) = 3.4
* .nodeset V(IN_M_OPTO) = 2.7
* .nodeset V(OPTO_EMITTER) = 2.5001
* .nodeset V(FB) = 2.5
* .nodeset V(5) ={Dcalc}
.tran 0 500m 0 startup
.model SW SW(Ron=10m, Roff=10Meg, Vt=2.5, Vh=-0.1)
.param Fs = 200k
.param Ts = {1.0/{Fs}}
.param D = 0.224
.param Cout = 650u
.param RL = 100
.param VIN = 30
.param VOUT =5.05
.param Lm = 9u
.param Ns_div_Np = {1/2}
.param Ls = ({Ns_div_Np}*{Ns_div_Np}*{Lm})
.param L = {Lm}
.param Fsw = {Fs}
.param n={Ns_div_Np}
.param Lprim_ideal = 0.1
.param Lsec_ideal = {{n}*{n}*{Lprim_ideal}}
.param Rsns = 0.1
.MODEL 1N5811   D      (
+         IS = 2.23137E-8
+         RS = 0.0679124
+          N = 1.5116445
+         TT = 2.263E-8
+        CJO = 1.48755E-10
+         VJ = 0.5130456
+          M = 0.4810824
+         EG = 1.11
+        XTI = 3
+         KF = 0
+         AF = 1
+         FC = 0.998001
+         BV = 1E5
+        IBV = 1E-10
+ )
*$
.options
+ Gmin = 1e-7
+ Abstol = 1e-7
+ Reltol = 0.001
+ Chgtol = 1e-8
+ Trtol = 2
+ vntol = 0.001
+ Sstol = 0.001
+ MinDeltaGmin = 0.0001
+ Method = Gear
.model Dideal D(Ron=1u Roff=10Meg Vfwd=1u Vrev=200)
* .ac dec 1k 1 10Meg
.param Dcalc = ({VOUT}/{VIN})/(SQRT(({RL}*{Ts})/(2*{Lm})))
.param VD_OPTO = 1.2
.param CTR={2.5}
.param RS_OPTO = 10.0
.param fc_OPTO = 74k
.savebias dc_operating_point.txt time=400m
.loadbias dc_operating_point.txt
.model Din_Opto D(Ron=1u Roff=10Meg Vfwd=1.2 Vrev=200)
.param RESR_COUT=50m
.param LESL_CCER=5n
.param LESL_CPOL=10n
.param Td_GATEDRV = {0.1*{Ts}}
.backanno
.end